# EasyEDA Pro project ProPrj_ETHlink8DAC_V1.0.epro, schematic ETHlink8xDAC_Schematic

## Sheets
1 DAC_1: Board Name: ETHlink8xDAC; Create Date: 2024-06-12; Page Name: DAC_1; Project Name: ETHlink8out; Schematic Name: ETHlink8xDAC_Schematic; Update Date: 2024-06-13; Company: EasyEDA.com; Drawn: Eugenio Mancini; Page Size: A4; Part Number: JLCPCB-002; Reviewed: EasyEDA; Version: V1.0
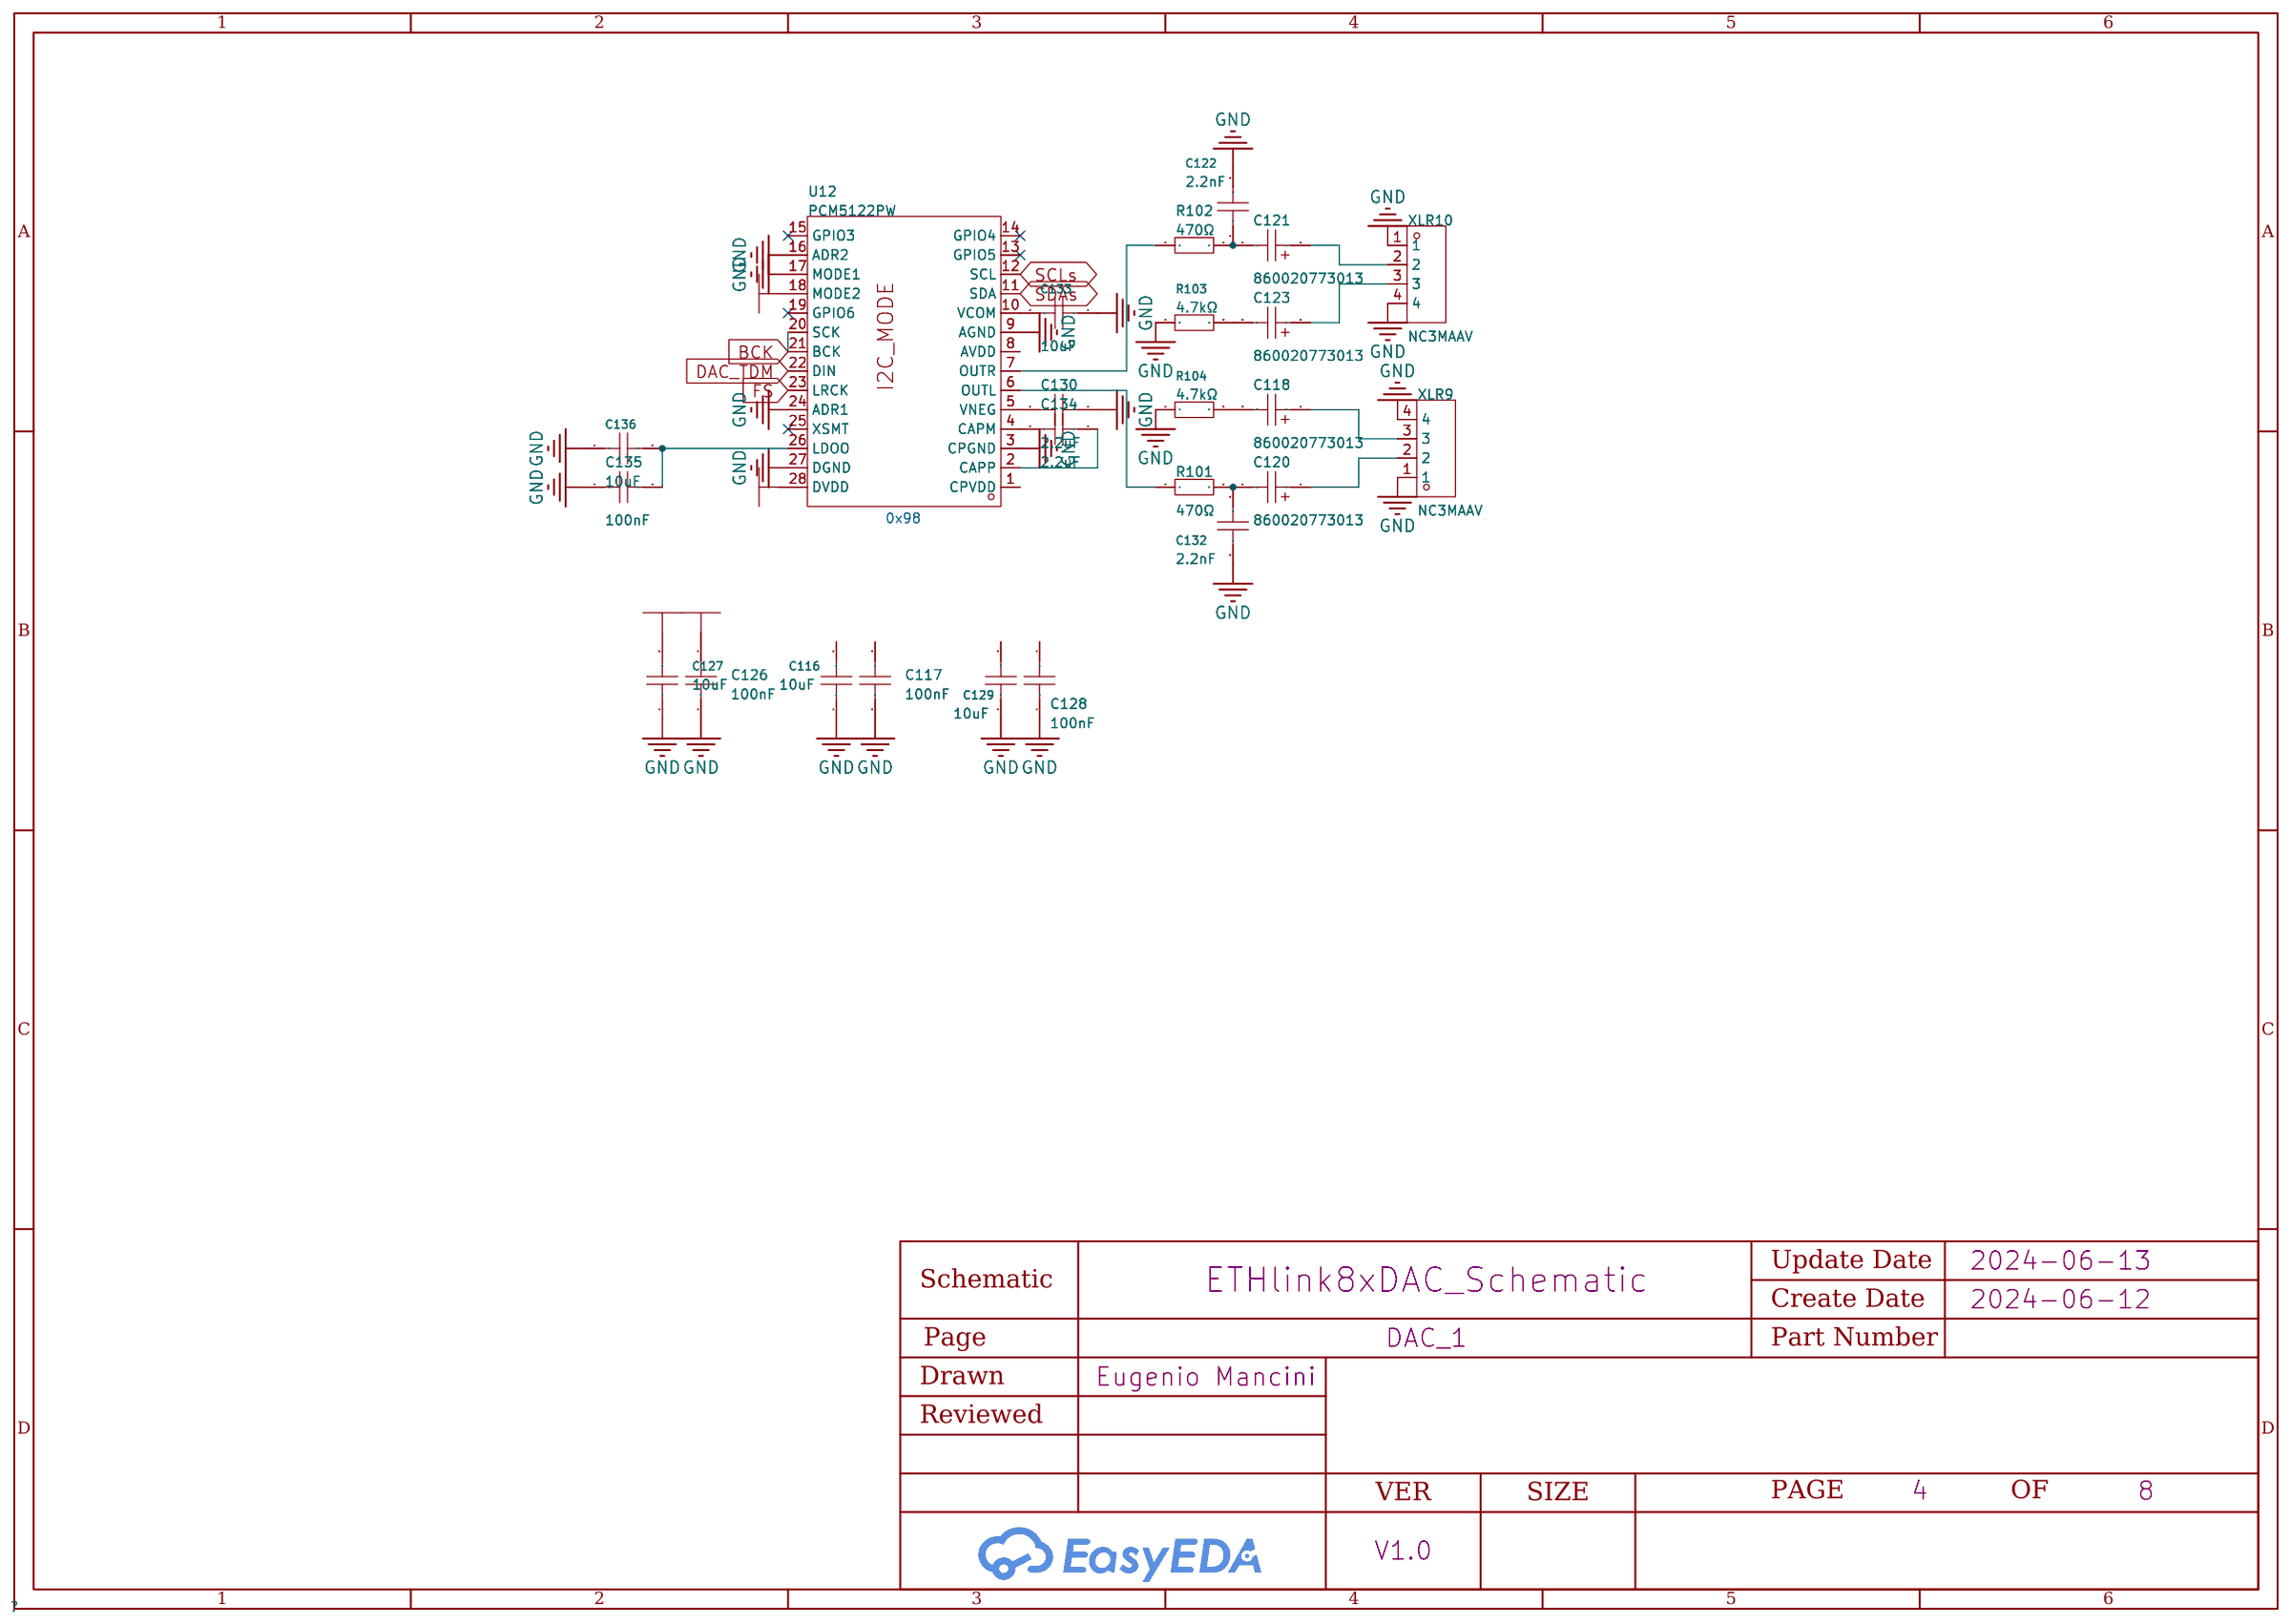
[diagram p0: DAC_1]
2 DAC_2: Page Name: DAC_2
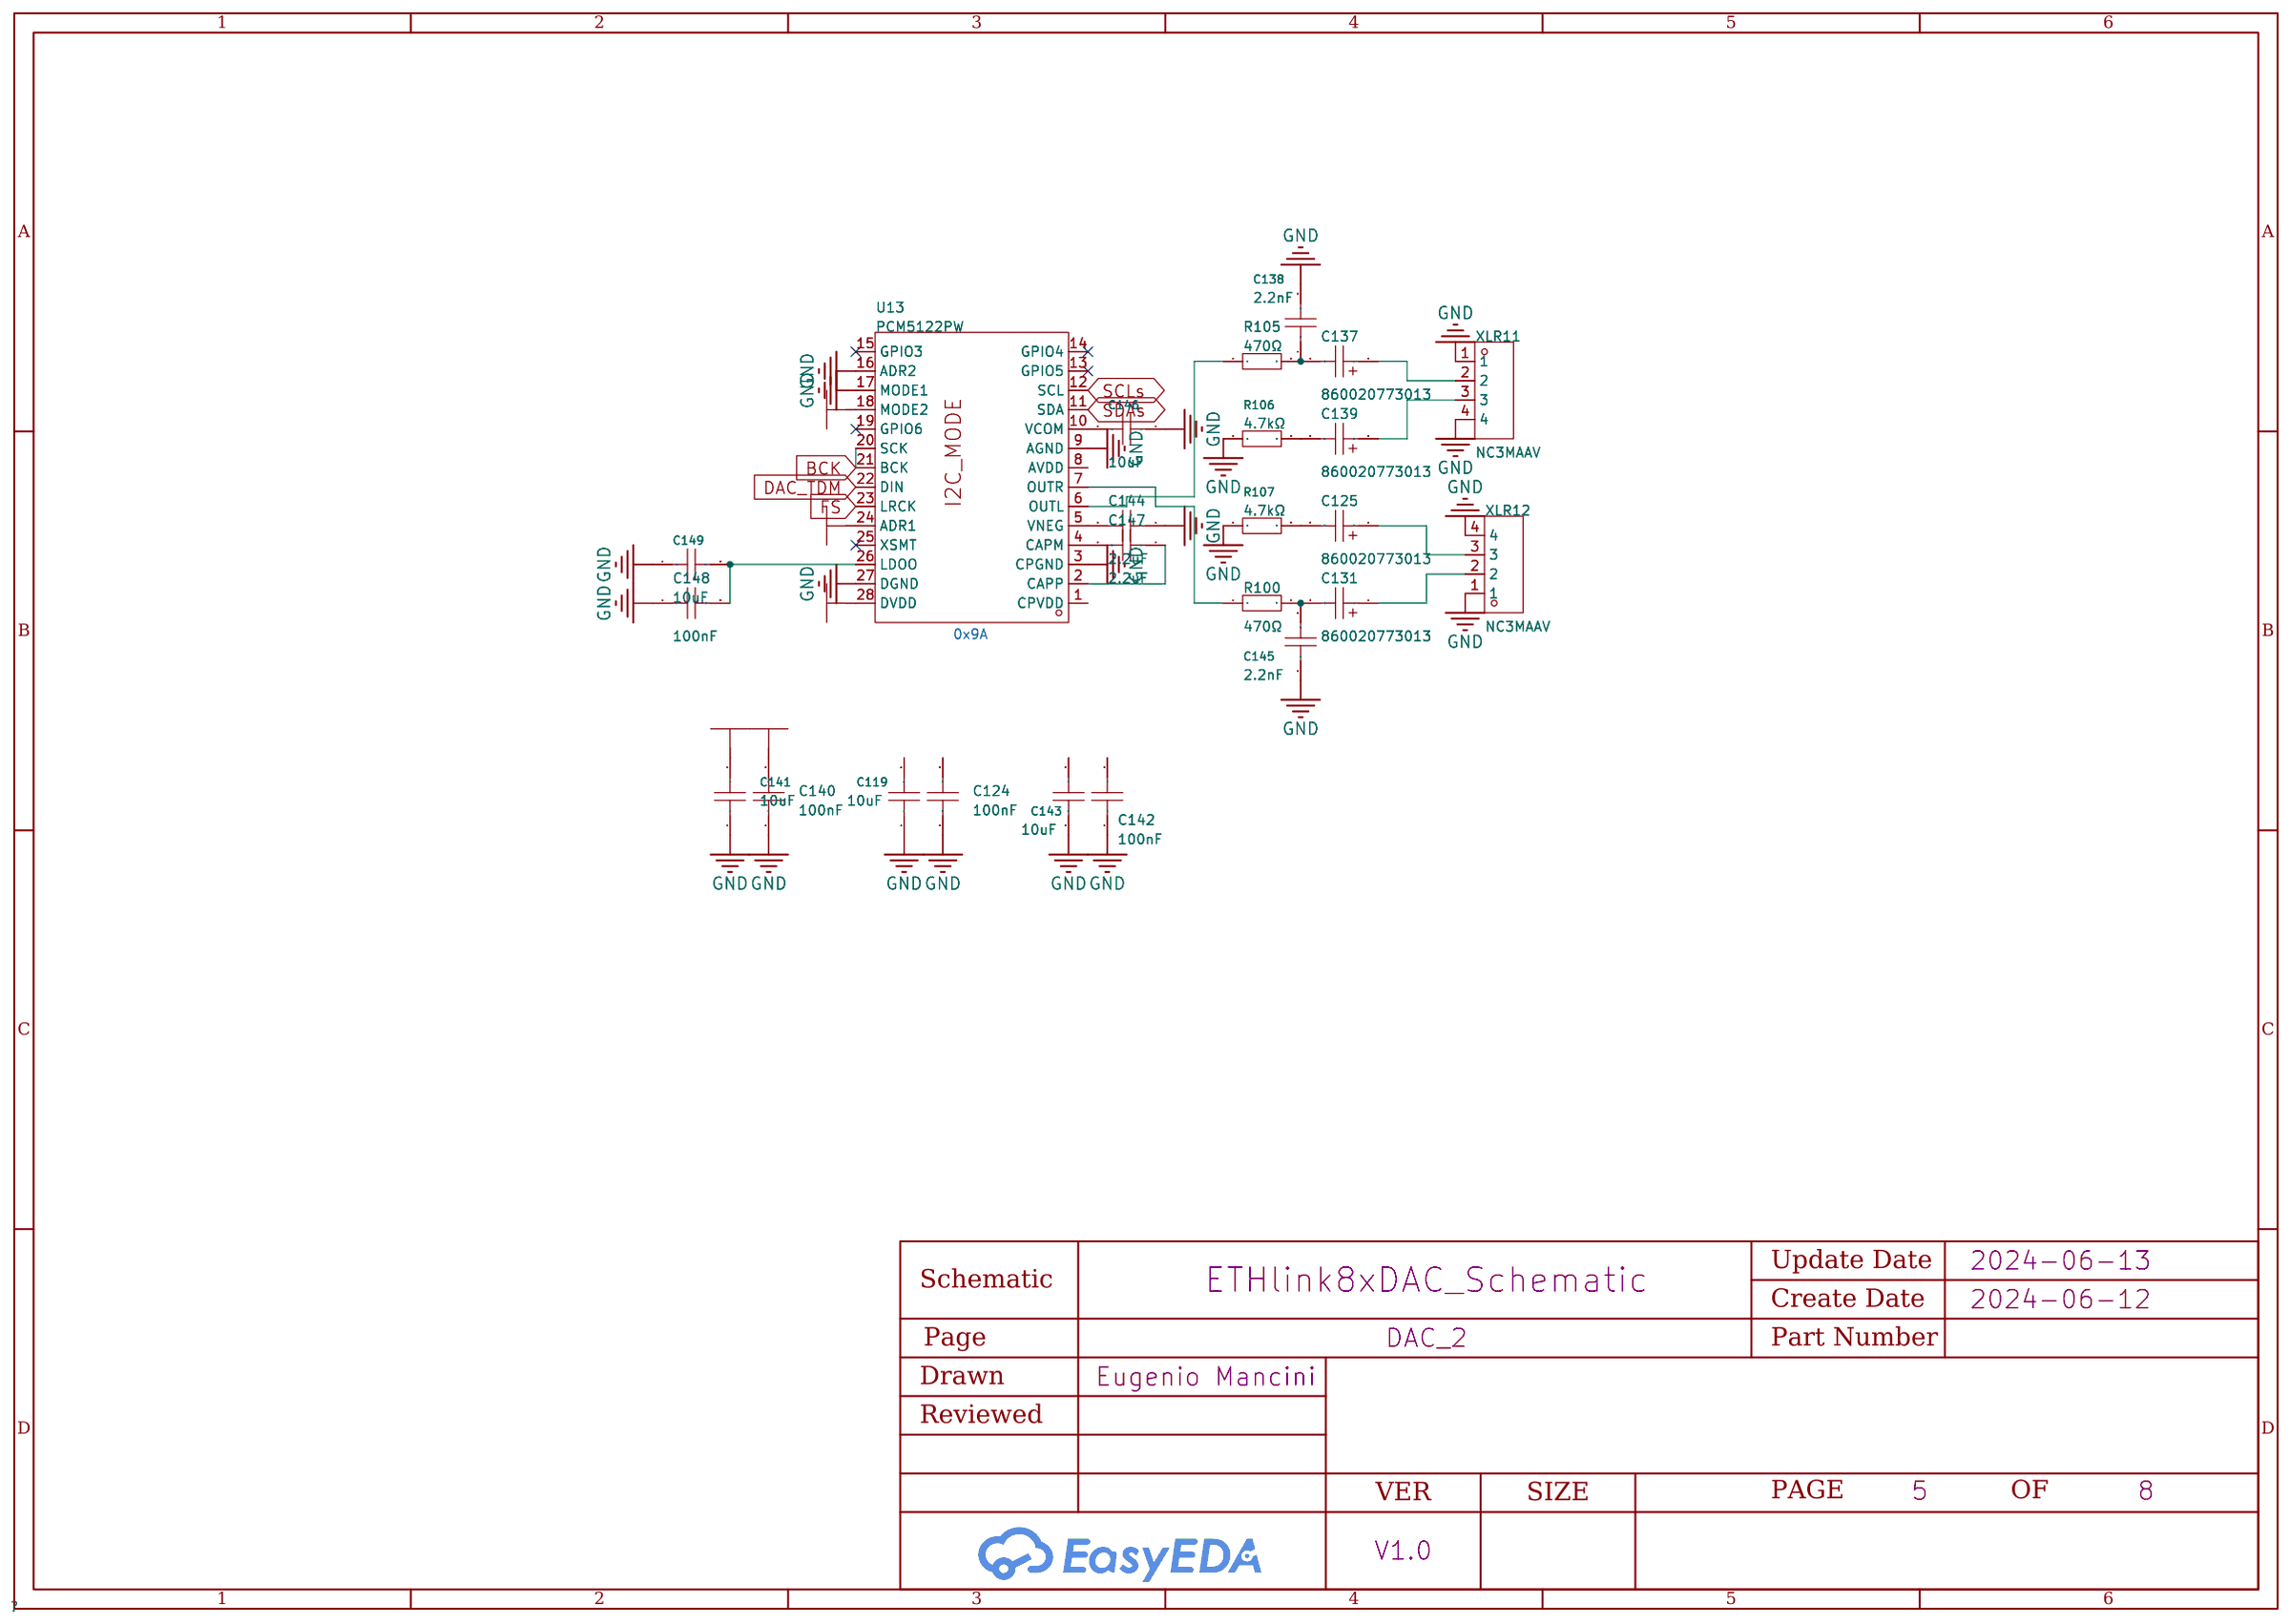
[diagram p1: DAC_2]
3 DAC_3: Page Name: DAC_3
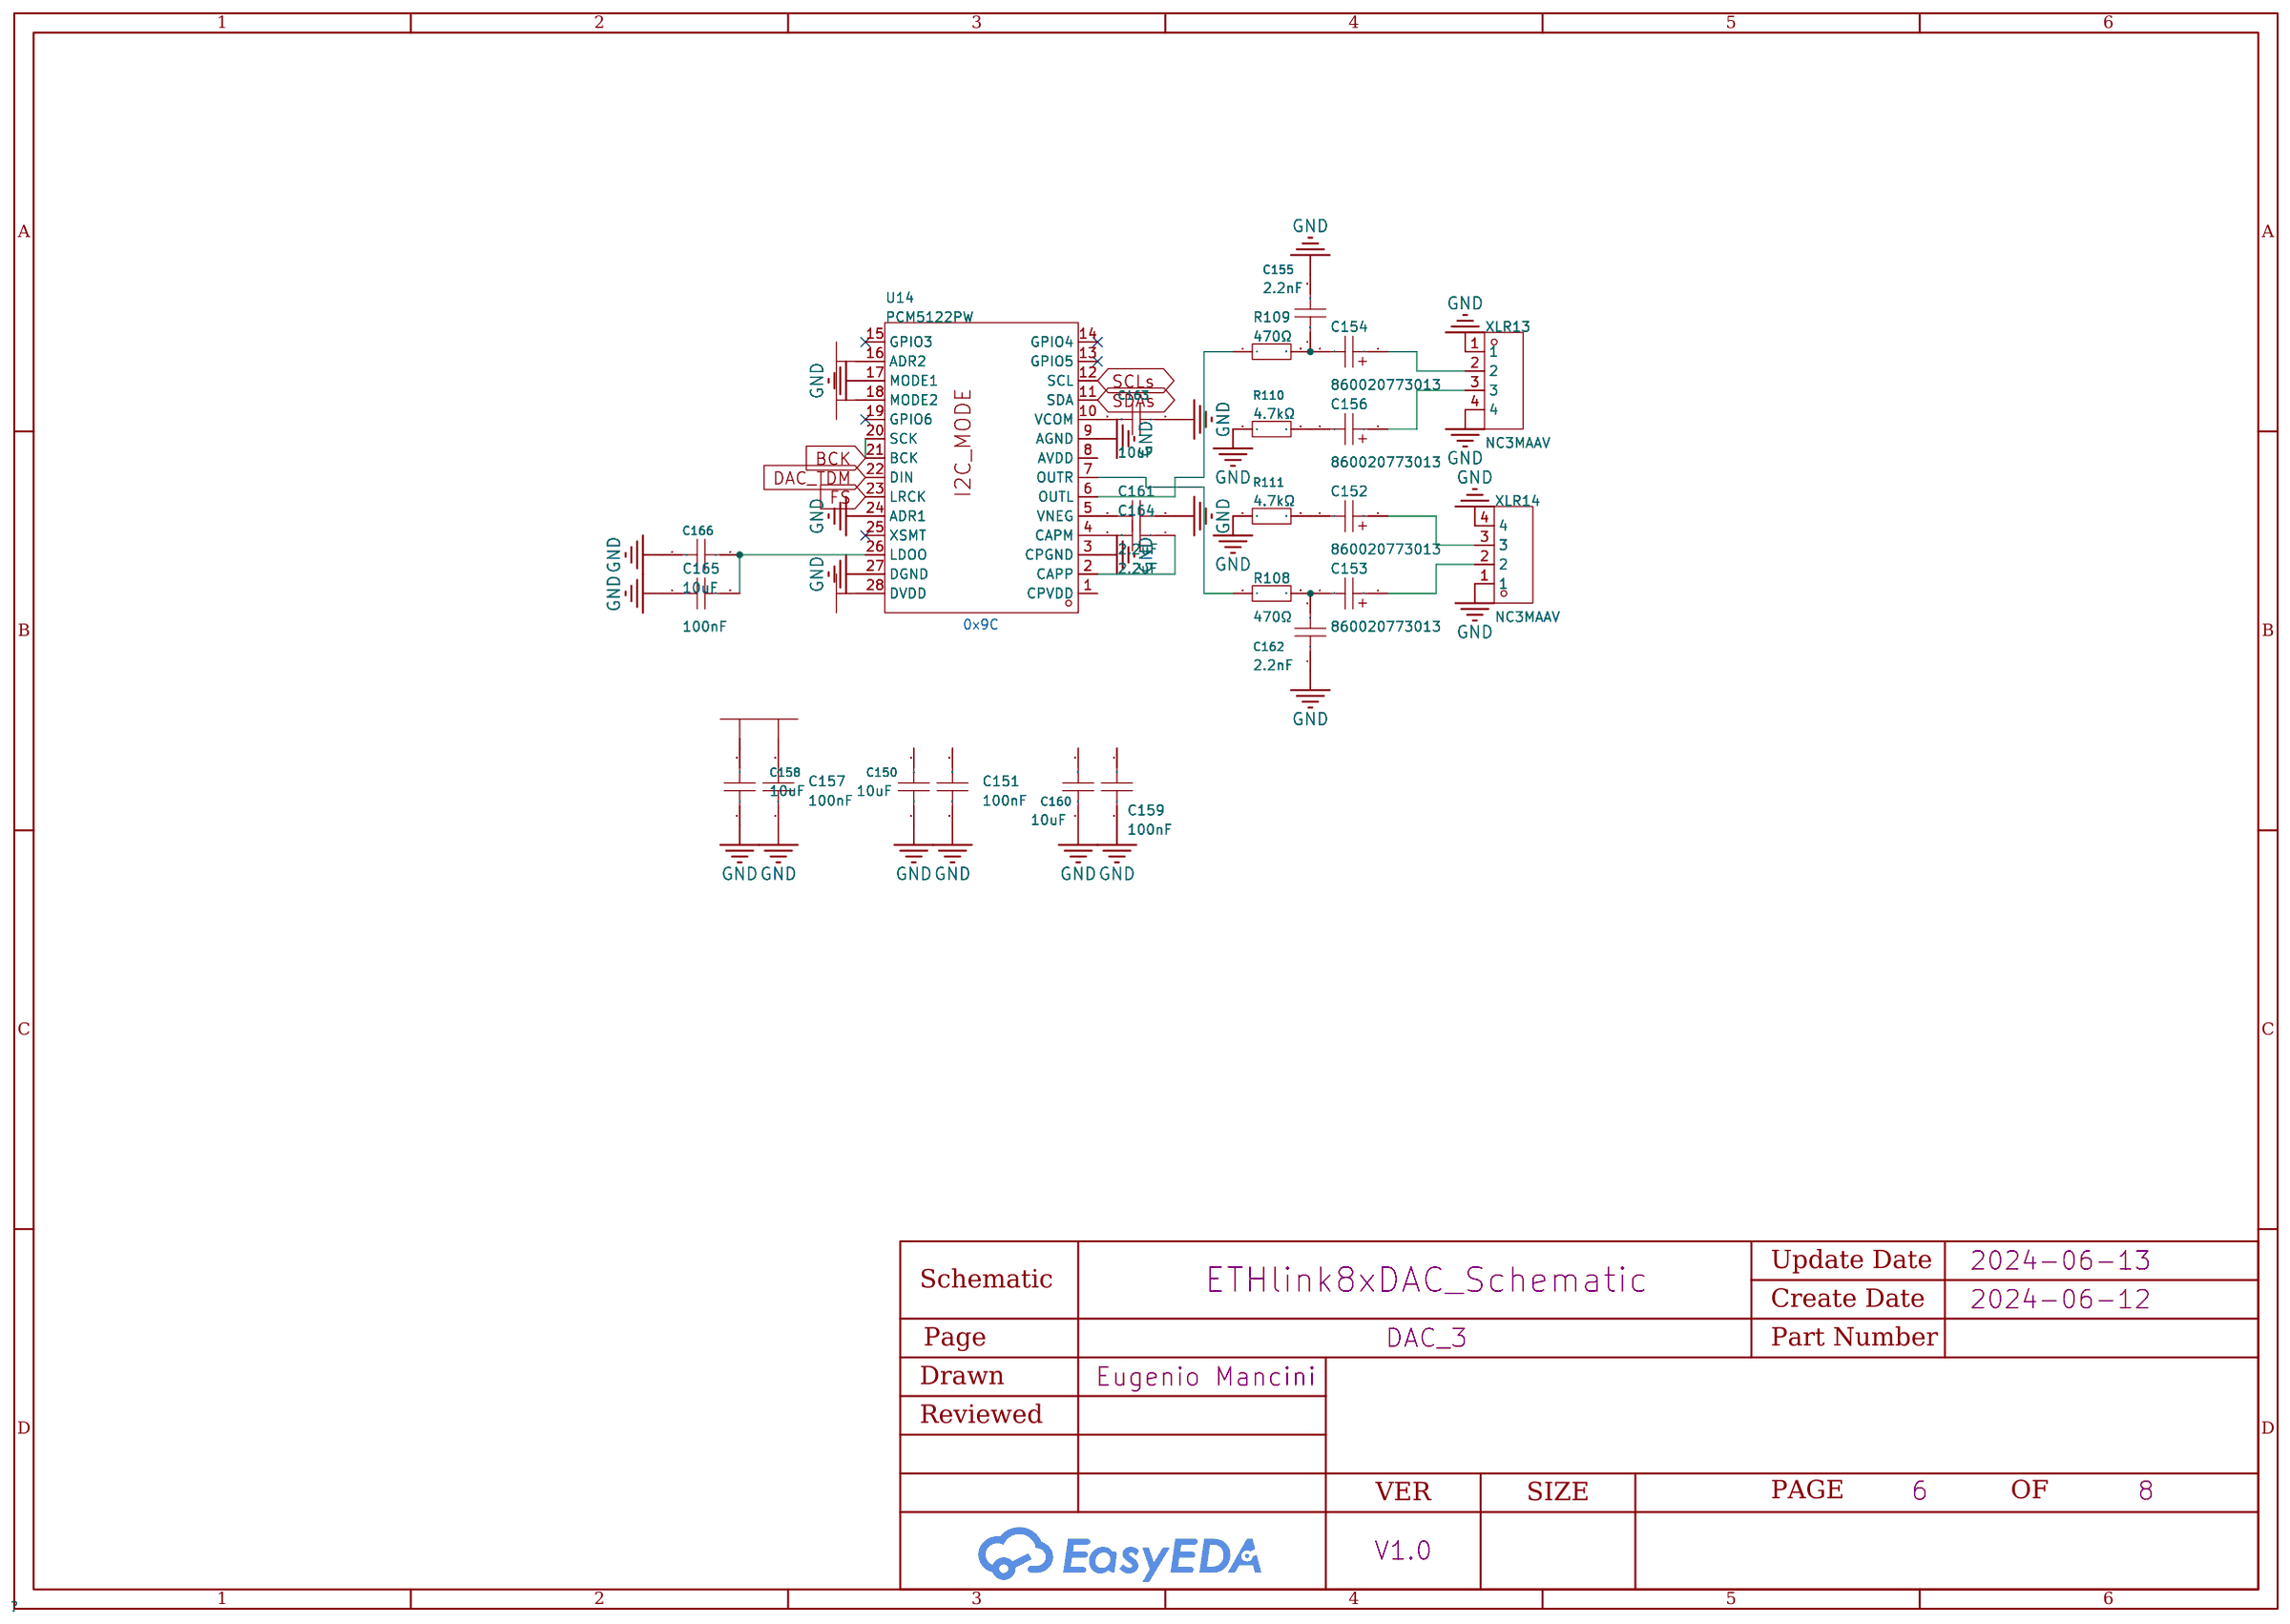
[diagram p2: DAC_3]
4 DAC_4: Page Name: DAC_4; Update Date: 2025-03-30
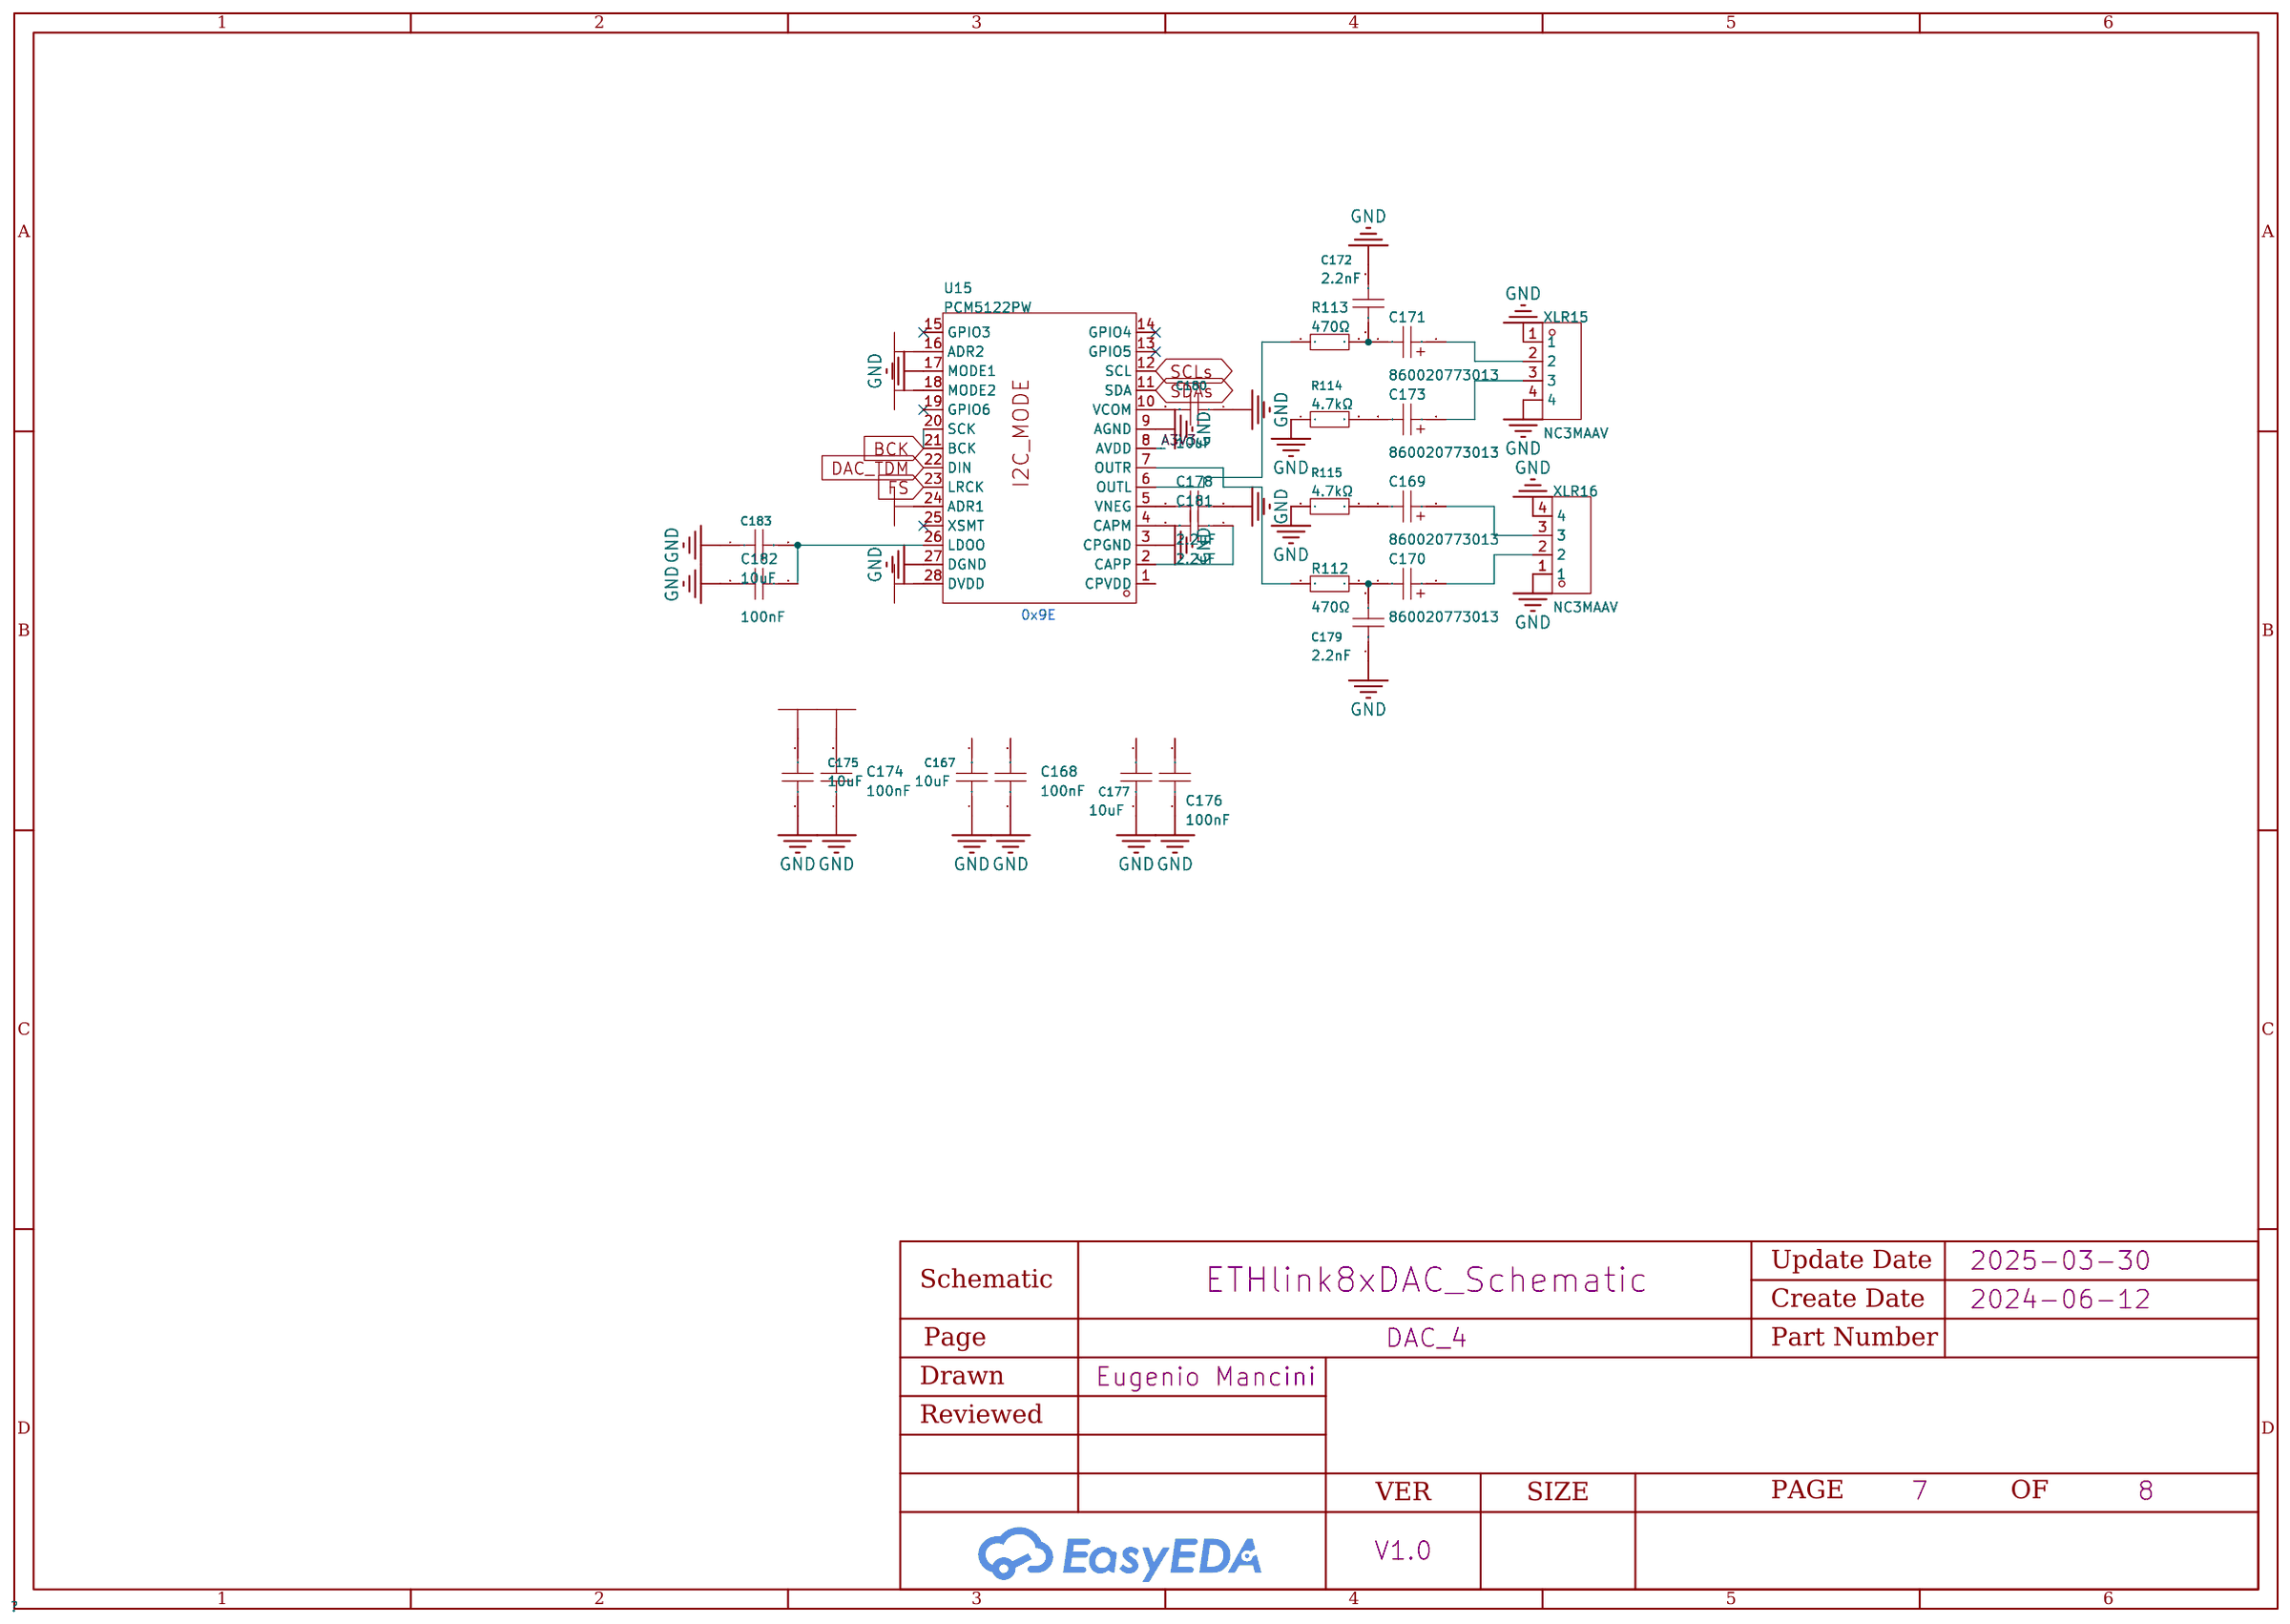
[diagram p3: DAC_4]
5 ETHERNET_PHY: Page Name: ETHERNET_PHY; Update Date: 2025-03-27
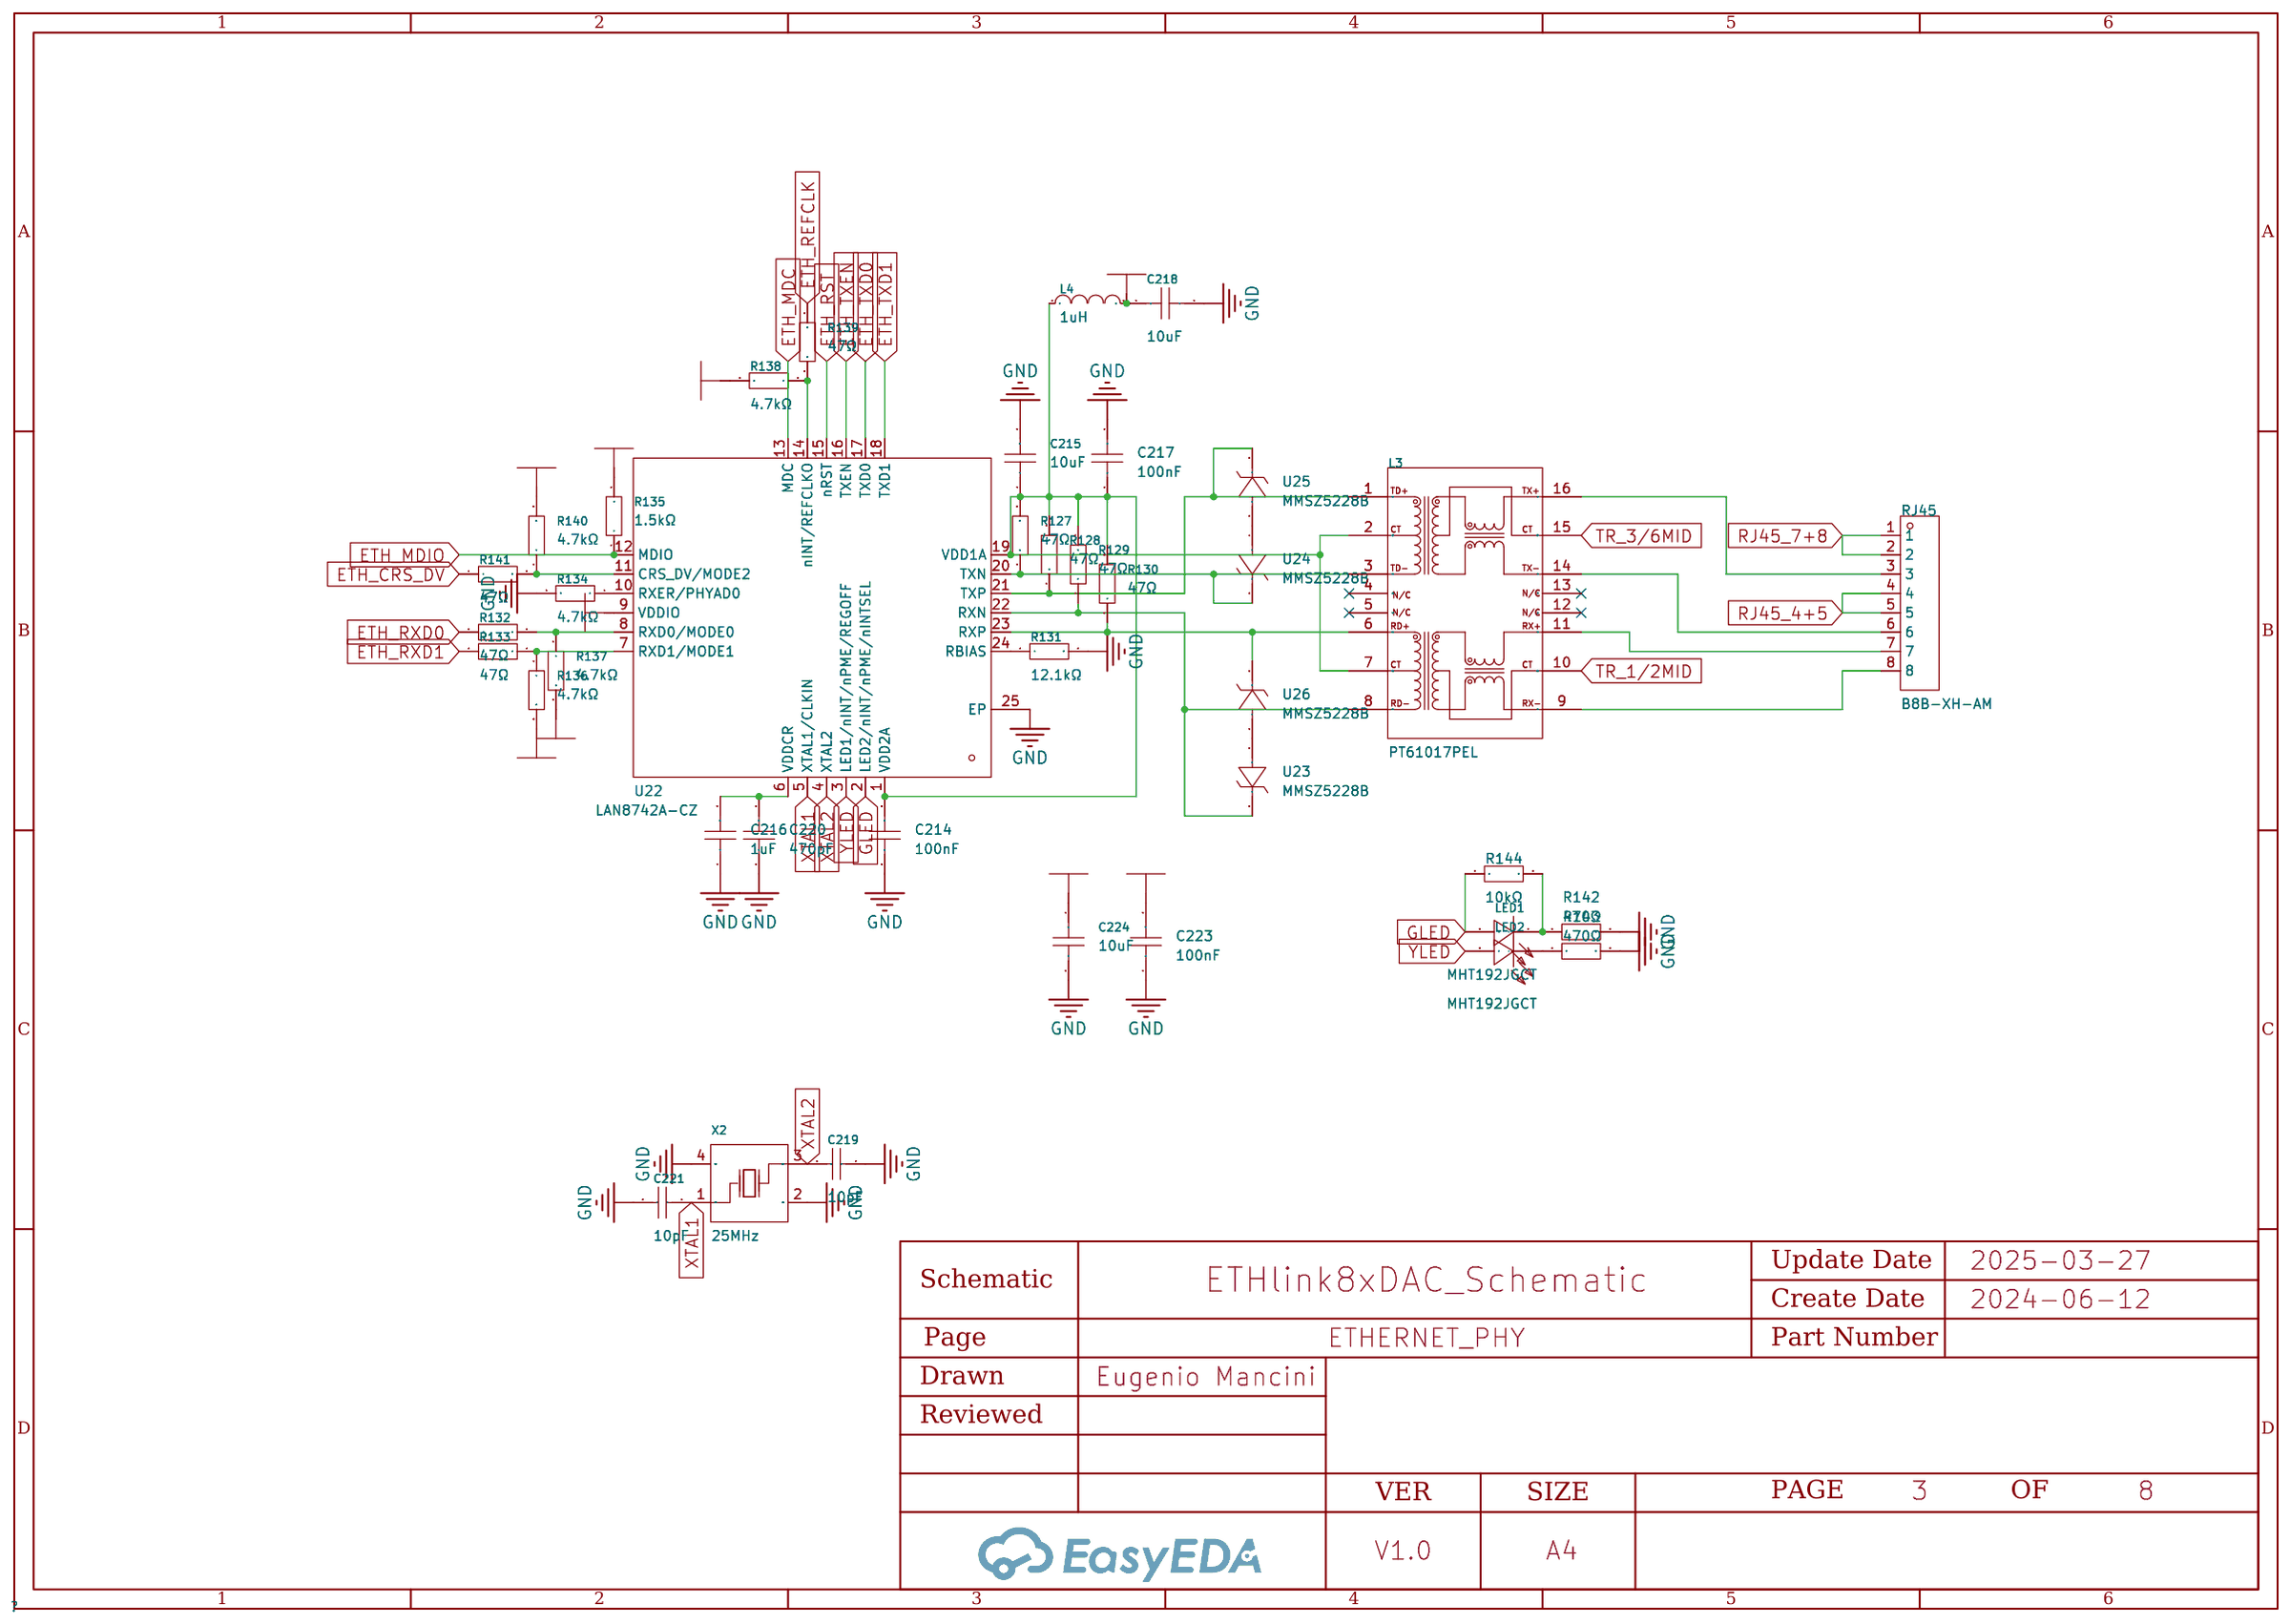
[diagram p4: ETHERNET_PHY]
6 MCU: Page Name: MCU; Update Date: 2024-07-15
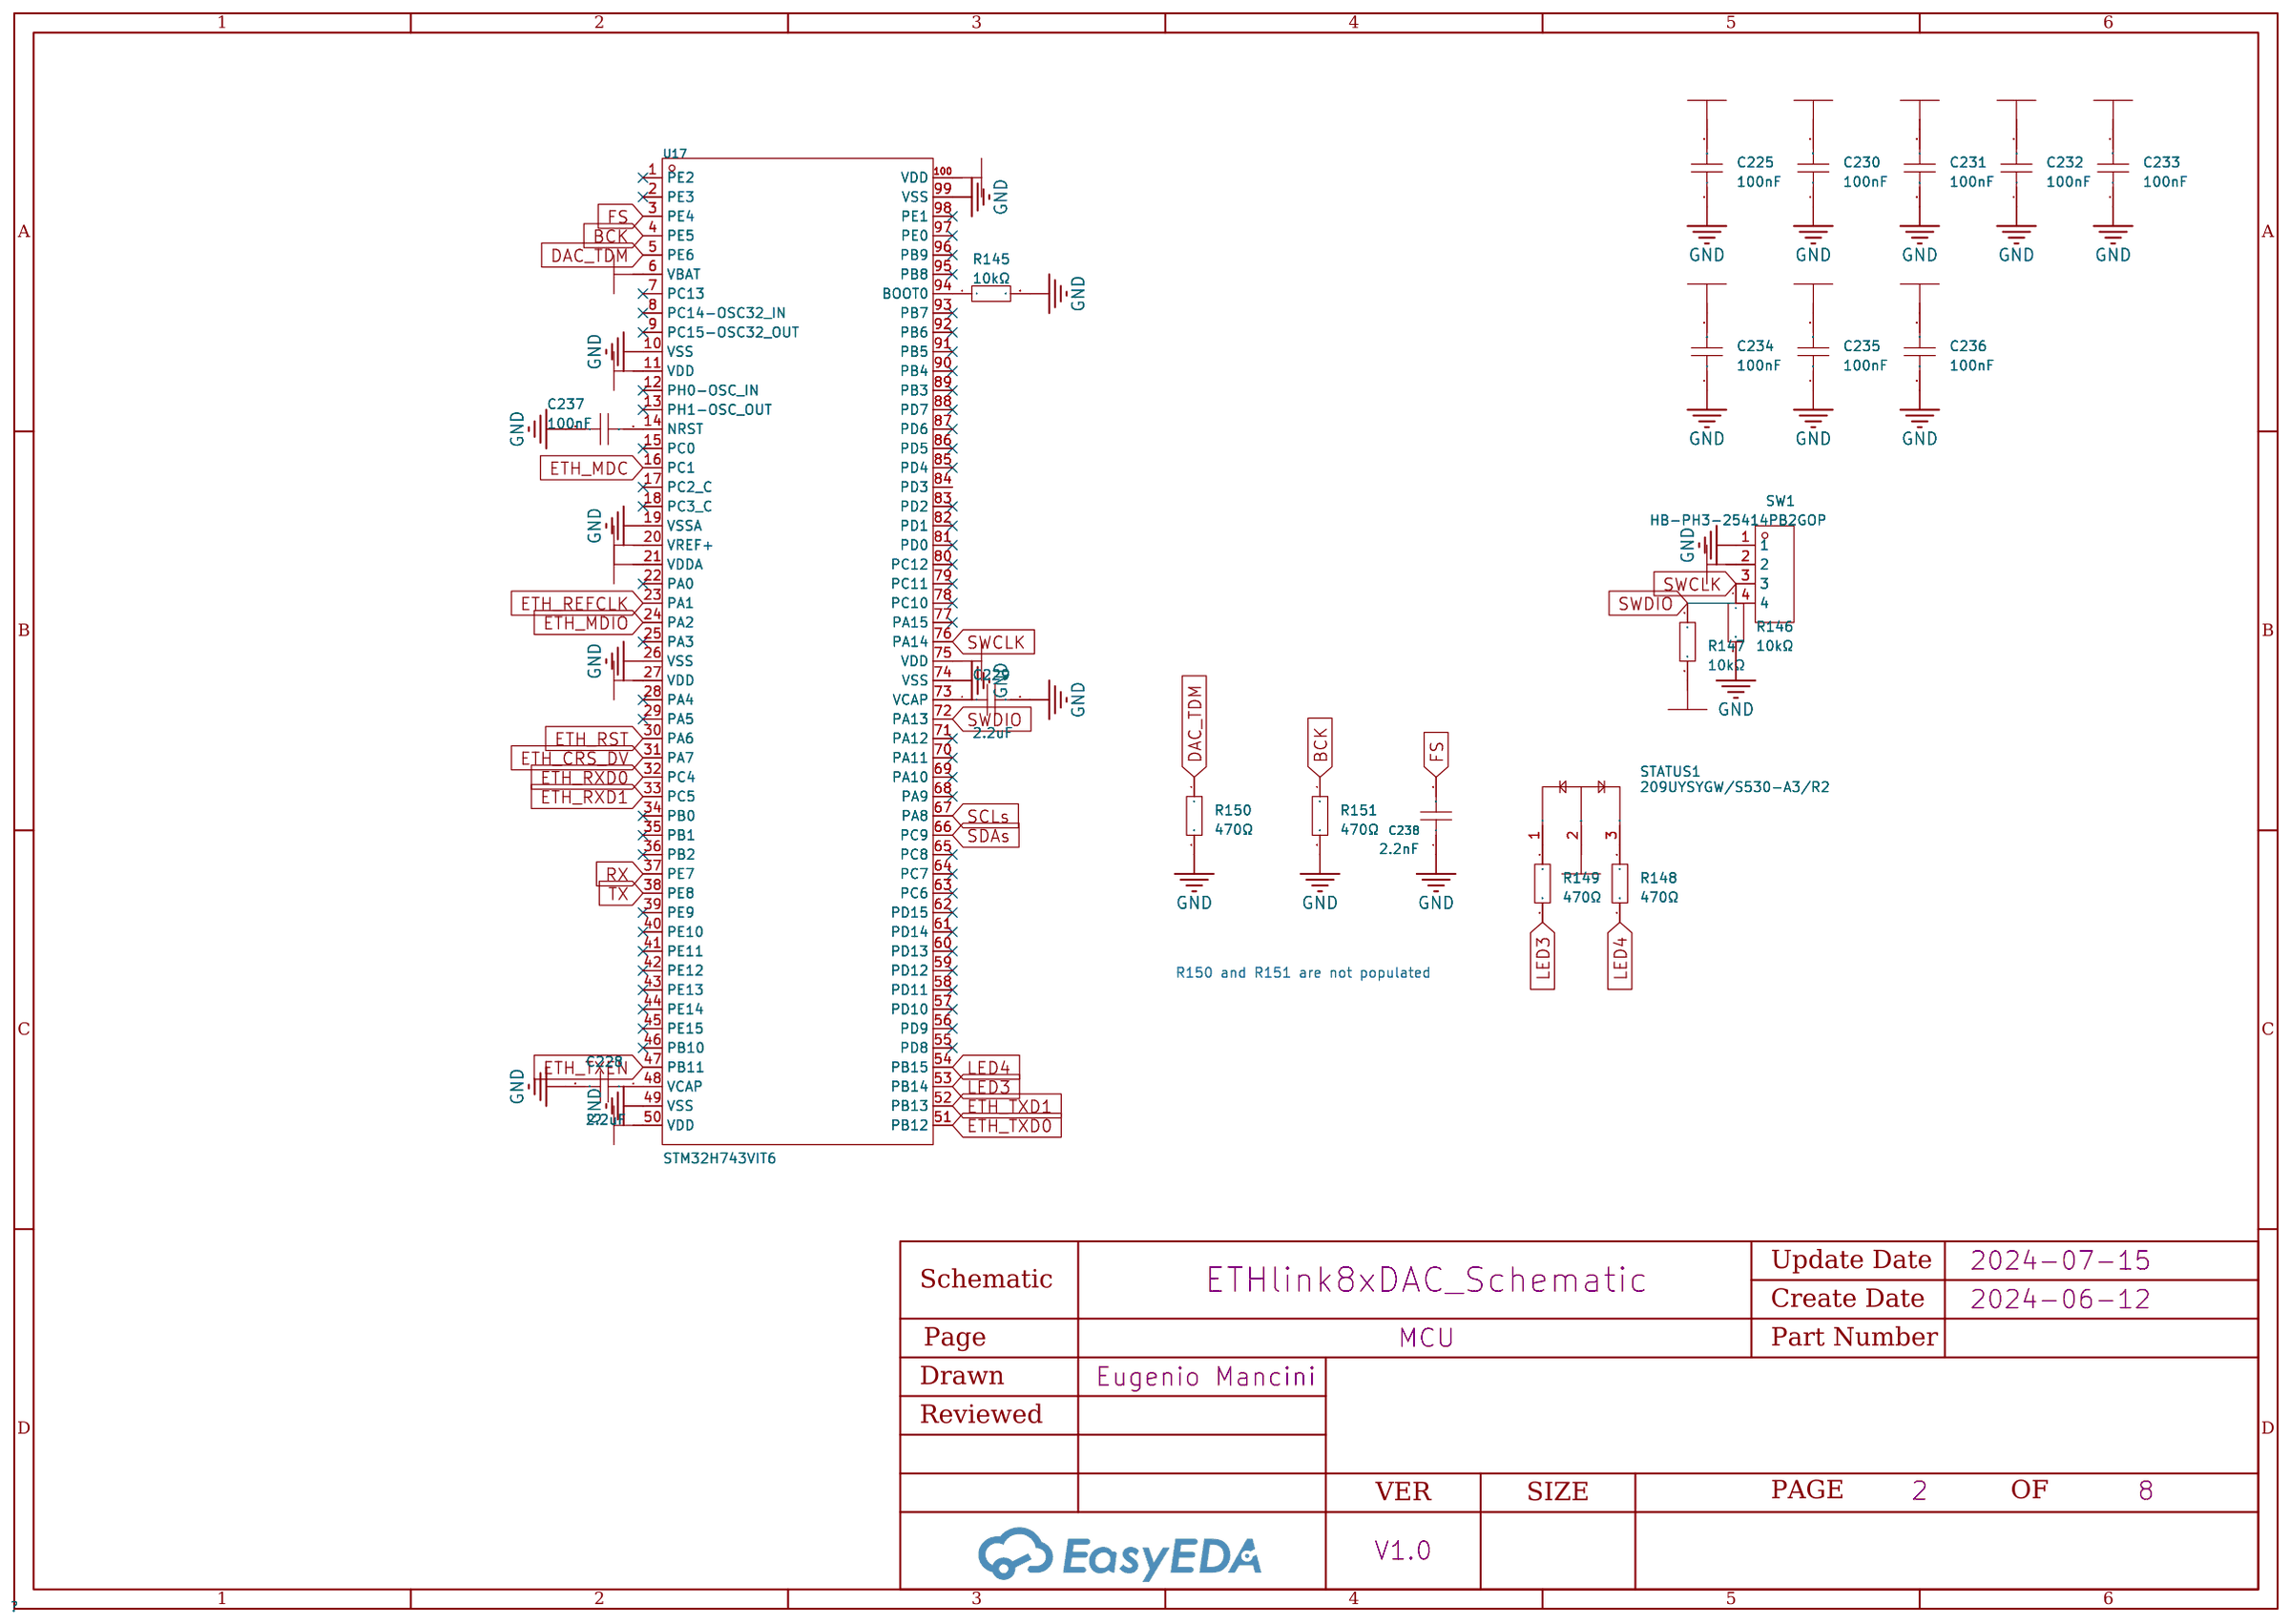
[diagram p5: MCU]
7 PSU: Page Name: PSU; Update Date: 2025-03-29
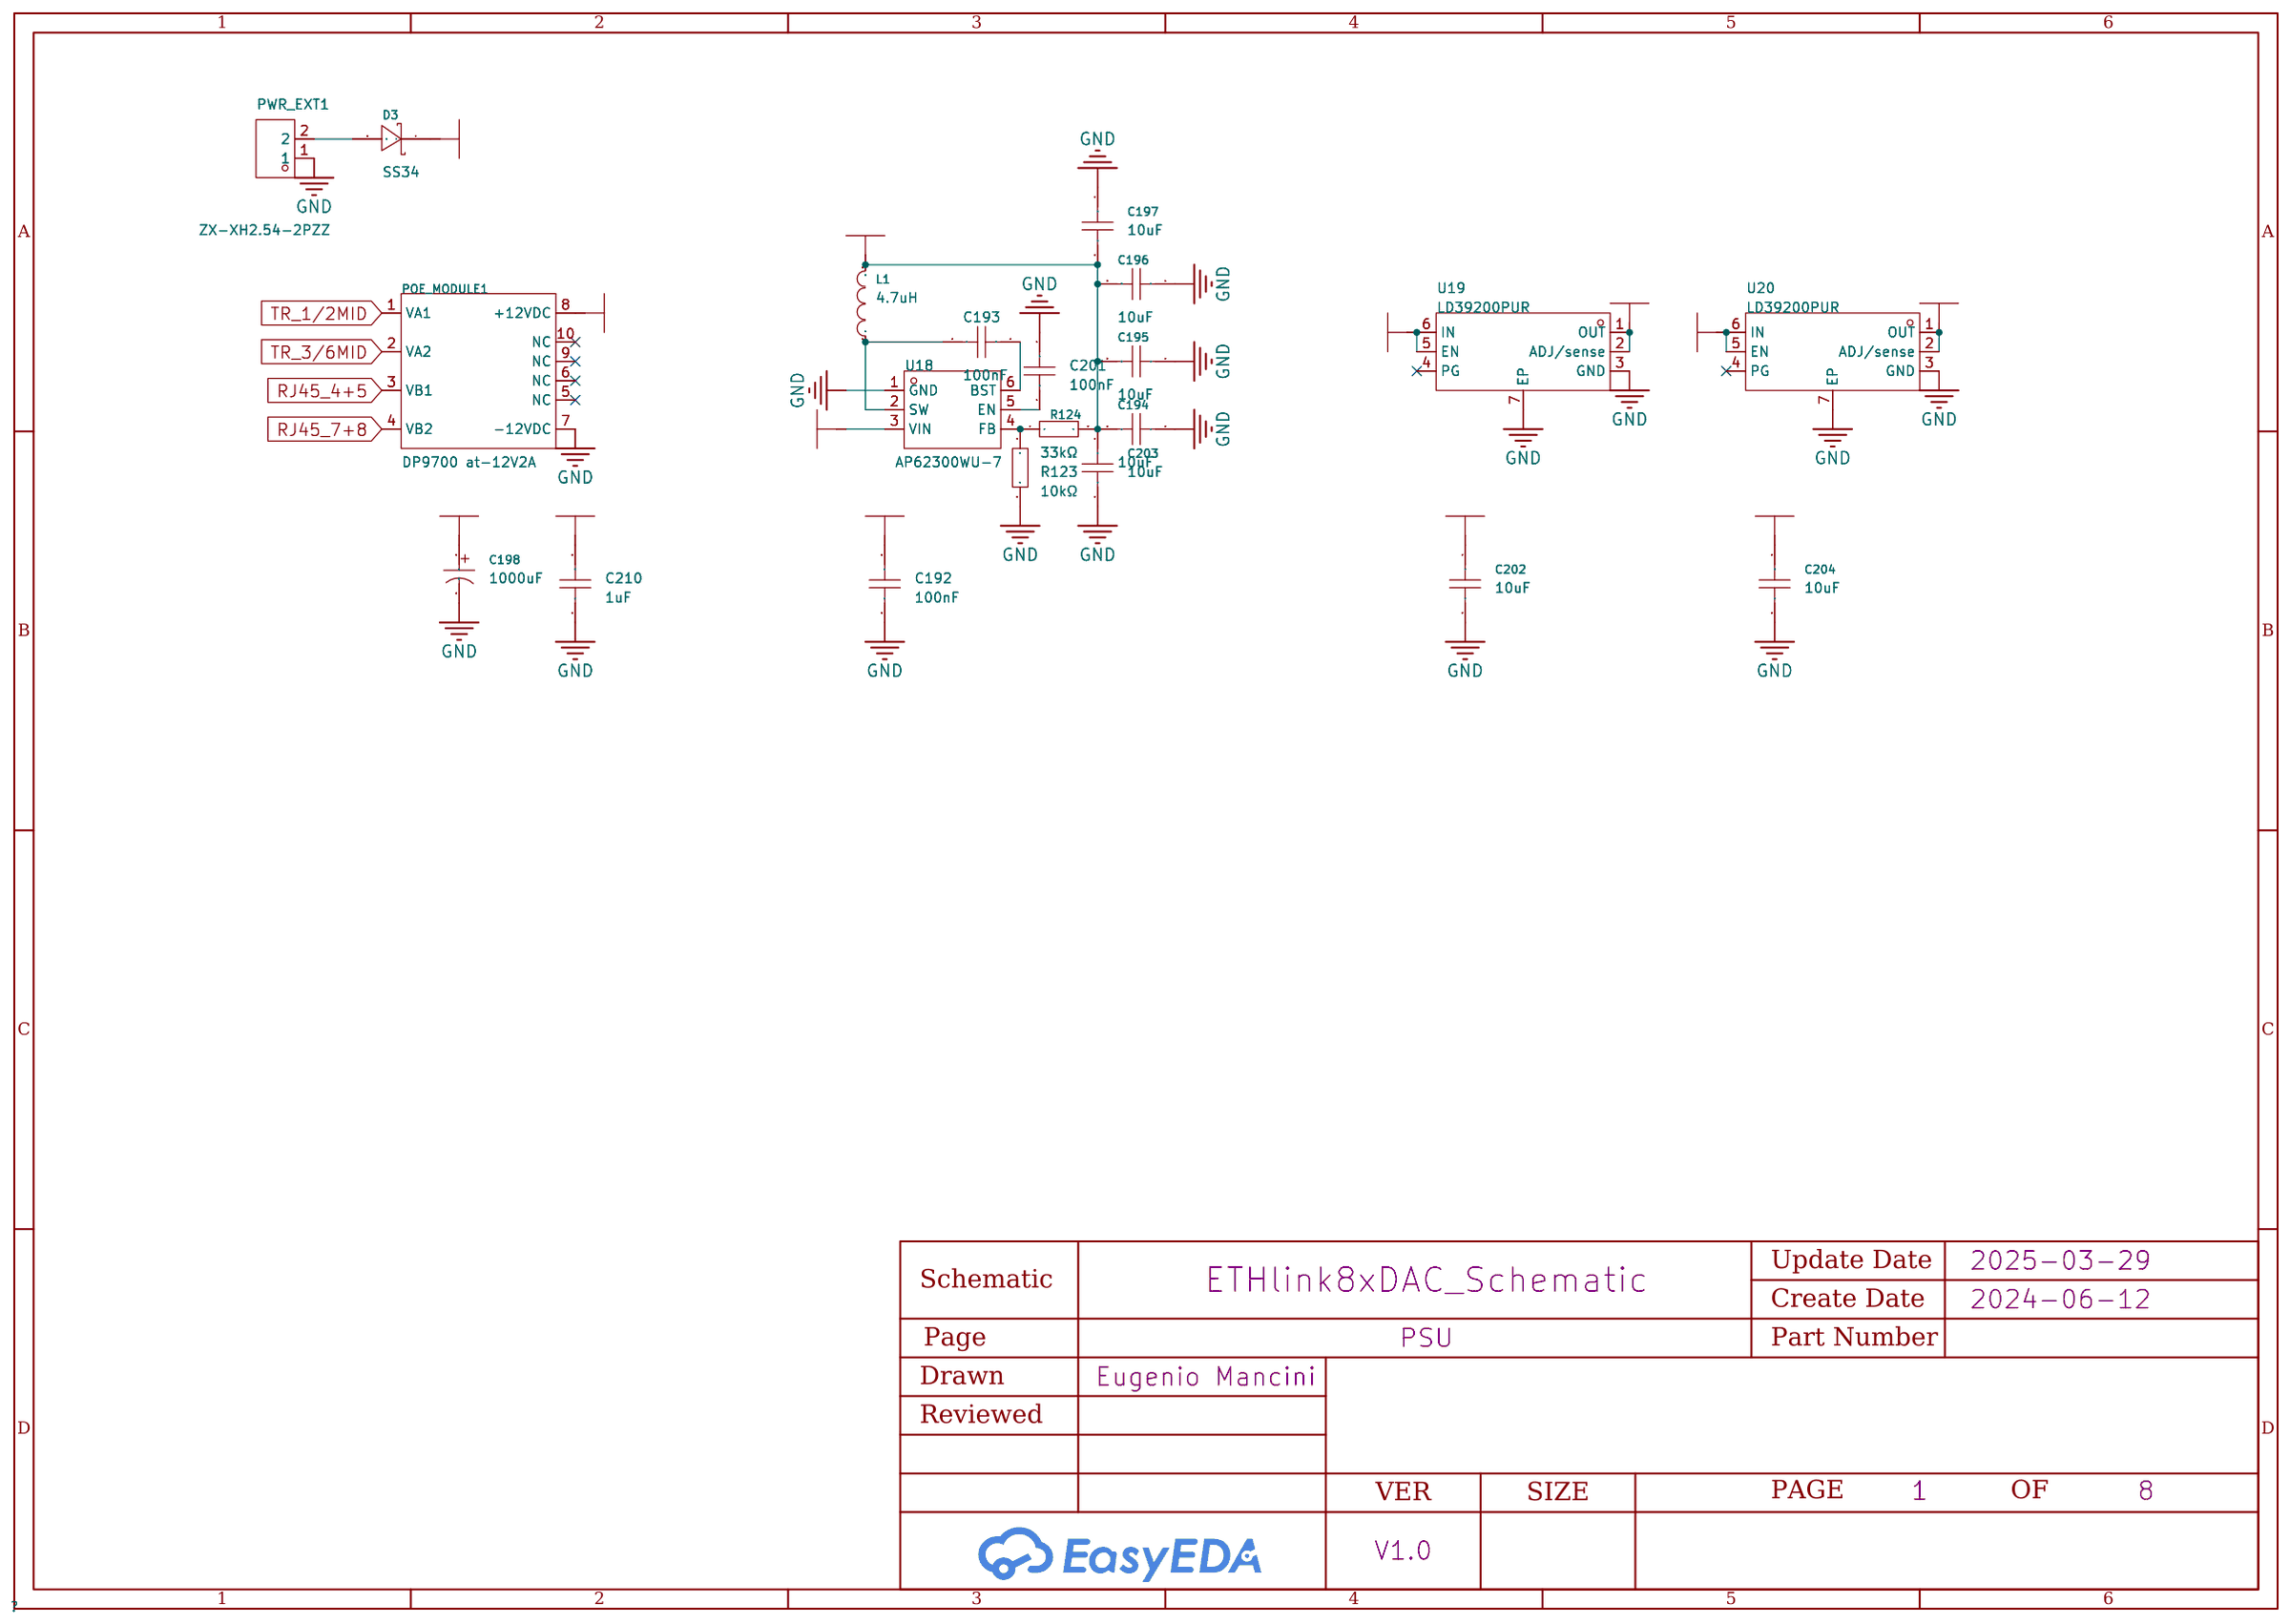
[diagram p6: PSU]
8 CLOCK: Create Date: 2024-06-13; Page Name: CLOCK; Drawn: eugenio mancini; Version: V0.1
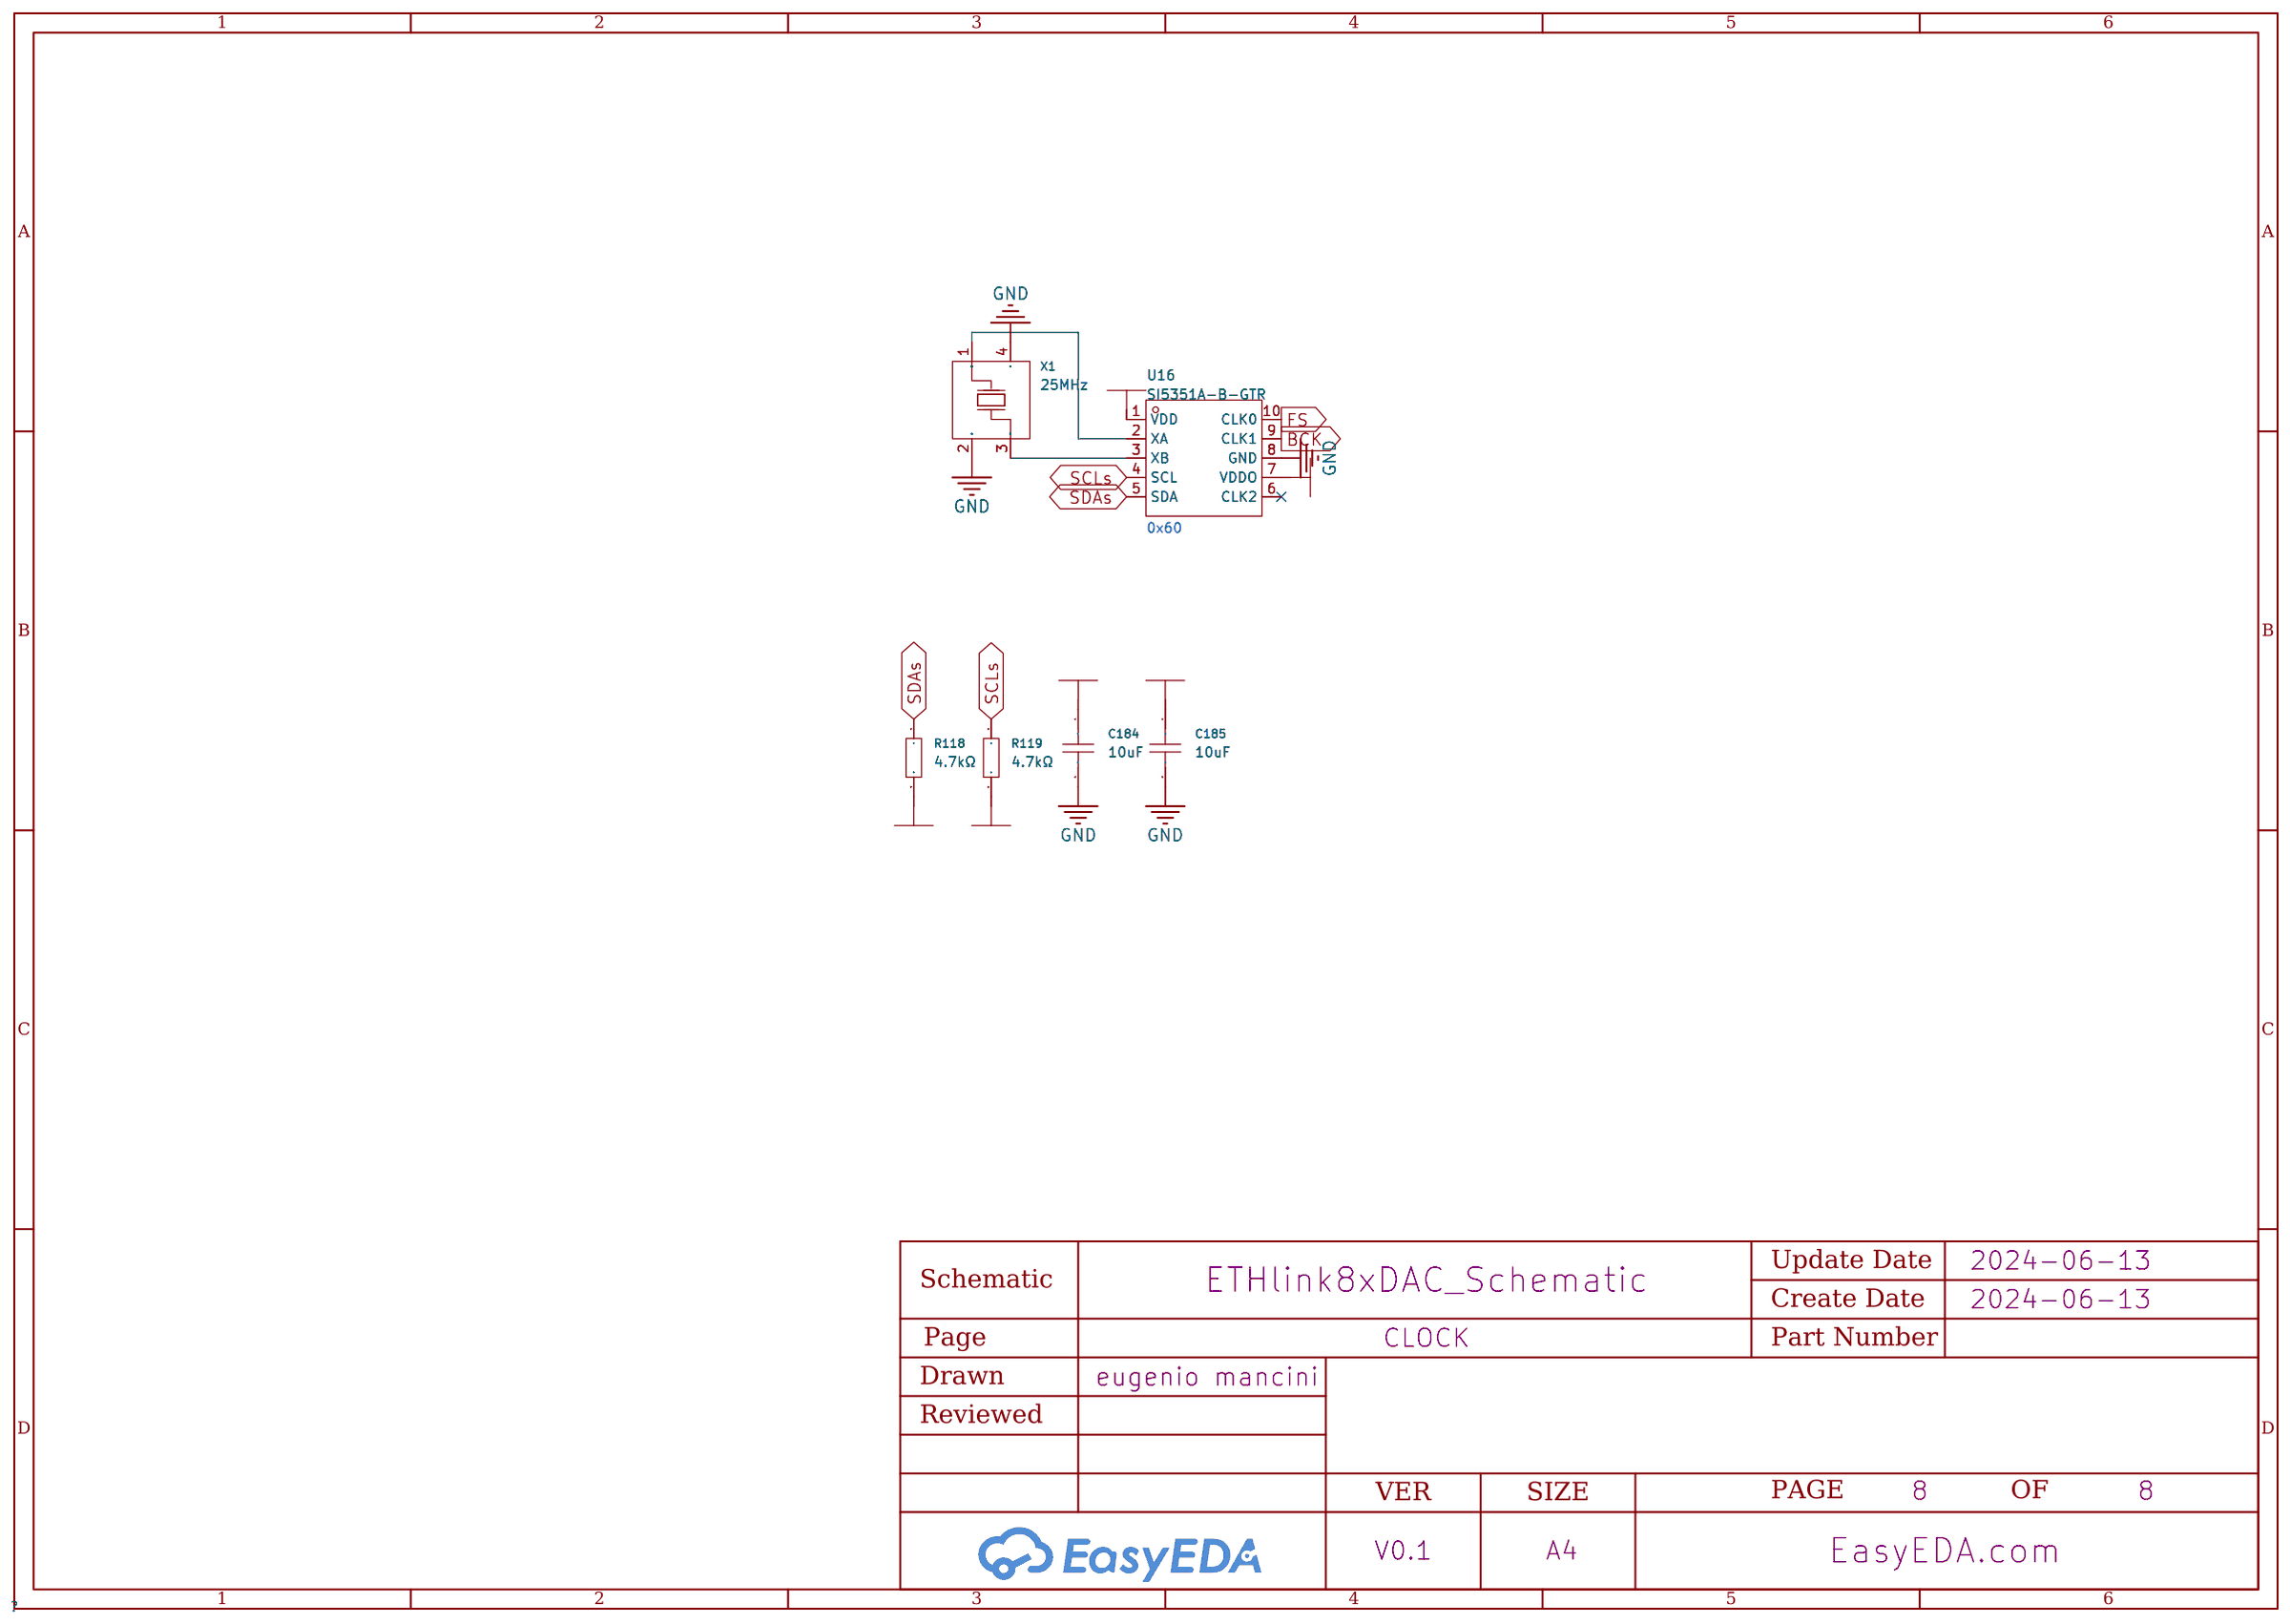
[diagram p7: CLOCK]

## Parts
sheet CLOCK
C184  10uF  [C0603]
C185  10uF  [C0603]
R118  4.7kΩ  [R0603]
R119  4.7kΩ  [R0603]
U16  SI5351A-B-GTR  [MSOP-10_L3.0-W3.0-P0.50-LS5.0-BL]
X1  25MHz  [CRYSTAL-SMD_4P-L3.2-W2.5-BL]
sheet DAC_1
C116  10uF  [C0603]
C117  100nF  [C0603]
C118  860020773013  [CAP-TH_BD6.3-P2.50-D0.5-FD]
C120  860020773013  [CAP-TH_BD6.3-P2.50-D0.5-FD]
C121  860020773013  [CAP-TH_BD6.3-P2.50-D0.5-FD]
C122  2.2nF  [C0603]
C123  860020773013  [CAP-TH_BD6.3-P2.50-D0.5-FD]
C126  100nF  [C0603]
C127  10uF  [C0603]
C128  100nF  [C0603]
C129  10uF  [C0603]
C130  2.2uF  [C0603]
C132  2.2nF  [C0603]
C133  10uF  [C0603]
C134  2.2uF  [C0603]
C135  100nF  [C0603]
C136  10uF  [C0603]
R101  470Ω  [R0603]
R102  470Ω  [R0603]
R103  4.7kΩ  [R0603]
R104  4.7kΩ  [R0603]
U12  PCM5122PW  [TSSOP-28_L9.8-W6.6-P0.65-BL]
XLR9  NC3MAAV  [CONN-TH_NC3MAAV]
XLR10  NC3MAAV  [CONN-TH_NC3MAAV]
sheet DAC_2
C119  10uF  [C0603]
C124  100nF  [C0603]
C125  860020773013  [CAP-TH_BD6.3-P2.50-D0.5-FD]
C131  860020773013  [CAP-TH_BD6.3-P2.50-D0.5-FD]
C137  860020773013  [CAP-TH_BD6.3-P2.50-D0.5-FD]
C138  2.2nF  [C0603]
C139  860020773013  [CAP-TH_BD6.3-P2.50-D0.5-FD]
C140  100nF  [C0603]
C141  10uF  [C0603]
C142  100nF  [C0603]
C143  10uF  [C0603]
C144  2.2uF  [C0603]
C145  2.2nF  [C0603]
C146  10uF  [C0603]
C147  2.2uF  [C0603]
C148  100nF  [C0603]
C149  10uF  [C0603]
R100  470Ω  [R0603]
R105  470Ω  [R0603]
R106  4.7kΩ  [R0603]
R107  4.7kΩ  [R0603]
U13  PCM5122PW  [TSSOP-28_L9.8-W6.6-P0.65-BL]
XLR11  NC3MAAV  [CONN-TH_NC3MAAV]
XLR12  NC3MAAV  [CONN-TH_NC3MAAV]
sheet DAC_3
C150  10uF  [C0603]
C151  100nF  [C0603]
C152  860020773013  [CAP-TH_BD6.3-P2.50-D0.5-FD]
C153  860020773013  [CAP-TH_BD6.3-P2.50-D0.5-FD]
C154  860020773013  [CAP-TH_BD6.3-P2.50-D0.5-FD]
C155  2.2nF  [C0603]
C156  860020773013  [CAP-TH_BD6.3-P2.50-D0.5-FD]
C157  100nF  [C0603]
C158  10uF  [C0603]
C159  100nF  [C0603]
C160  10uF  [C0603]
C161  2.2uF  [C0603]
C162  2.2nF  [C0603]
C163  10uF  [C0603]
C164  2.2uF  [C0603]
C165  100nF  [C0603]
C166  10uF  [C0603]
R108  470Ω  [R0603]
R109  470Ω  [R0603]
R110  4.7kΩ  [R0603]
R111  4.7kΩ  [R0603]
U14  PCM5122PW  [TSSOP-28_L9.8-W6.6-P0.65-BL]
XLR13  NC3MAAV  [CONN-TH_NC3MAAV]
XLR14  NC3MAAV  [CONN-TH_NC3MAAV]
sheet DAC_4
C167  10uF  [C0603]
C168  100nF  [C0603]
C169  860020773013  [CAP-TH_BD6.3-P2.50-D0.5-FD]
C170  860020773013  [CAP-TH_BD6.3-P2.50-D0.5-FD]
C171  860020773013  [CAP-TH_BD6.3-P2.50-D0.5-FD]
C172  2.2nF  [C0603]
C173  860020773013  [CAP-TH_BD6.3-P2.50-D0.5-FD]
C174  100nF  [C0603]
C175  10uF  [C0603]
C176  100nF  [C0603]
C177  10uF  [C0603]
C178  2.2uF  [C0603]
C179  2.2nF  [C0603]
C180  10uF  [C0603]
C181  2.2uF  [C0603]
C182  100nF  [C0603]
C183  10uF  [C0603]
R112  470Ω  [R0603]
R113  470Ω  [R0603]
R114  4.7kΩ  [R0603]
R115  4.7kΩ  [R0603]
U15  PCM5122PW  [TSSOP-28_L9.8-W6.6-P0.65-BL]
XLR15  NC3MAAV  [CONN-TH_NC3MAAV]
XLR16  NC3MAAV  [CONN-TH_NC3MAAV]
sheet ETHERNET_PHY
C214  100nF  [C0603]
C215  10uF  [C0603]
C216  1uF  [C0603]
C217  100nF  [C0603]
C218  10uF  [C0603]
C219  10pF  [C0603]
C220  470pF  [C0603]
C221  10pF  [C0603]
C223  100nF  [C0603]
C224  10uF  [C0603]
L3  PT61017PEL  [XFMR-SMD_PT61017PEL]
L4  1uH  [L1008]
LED1  MHT192JGCT  [LED0603-RD]
LED2  MHT192JGCT  [LED0603-RD]
R127  47Ω  [R0603]
R128  47Ω  [R0603]
R129  47Ω  [R0603]
R130  47Ω  [R0603]
R131  12.1kΩ  [R0603]
R132  47Ω  [R0603]
R133  47Ω  [R0603]
R134  4.7kΩ  [R0603]
R135  1.5kΩ  [R0603]
R136  4.7kΩ  [R0603]
R137  4.7kΩ  [R0603]
R138  4.7kΩ  [R0603]
R139  47Ω  [R0603]
R140  4.7kΩ  [R0603]
R141  47Ω  [R0603]
R142  470Ω  [R0603]
R143  470Ω  [R0603]
R144  10kΩ  [R0603]
RJ45  B8B-XH-AM  [CONN-TH_8P-P2.50_B8B-XH-AM-LF-SN]
U22  LAN8742A-CZ  [QFN-24_L4.0-W4.0-P0.50-BL-EP2.6]
U23  MMSZ5228B  [SOD-123_L2.8-W1.8-LS3.9-FD]
U24  MMSZ5228B  [SOD-123_L2.8-W1.8-LS3.9-FD]
U25  MMSZ5228B  [SOD-123_L2.8-W1.8-LS3.9-FD]
U26  MMSZ5228B  [SOD-123_L2.8-W1.8-LS3.9-FD]
X2  25MHz  [CRYSTAL-SMD_4P-L3.2-W2.5-BL]
sheet MCU
C225  100nF  [C0603]
C228  2.2uF  [C0603]
C229  2.2uF  [C0603]
C230  100nF  [C0603]
C231  100nF  [C0603]
C232  100nF  [C0603]
C233  100nF  [C0603]
C234  100nF  [C0603]
C235  100nF  [C0603]
C236  100nF  [C0603]
C237  100nF  [C0603]
C238  2.2nF  [C0603]
R145  10kΩ  [R0603]
R146  10kΩ  [R0603]
R147  10kΩ  [R0603]
R148  470Ω  [R0603]
R149  470Ω  [R0603]
R150  470Ω  [R0603]
R151  470Ω  [R0603]
STATUS1  209UYSYGW/S530-A3/R2  [LED-TH_3P-BD4.0-P2.54]
SW1  HB-PH3-25414PB2GOP  [HDR-TH_4P-P2.54-V-M]
U17  STM32H743VIT6  [LQFP-100_L14.0-W14.0-P0.50-LS16.0-BL]
sheet PSU
C192  100nF  [C0603]
C193  100nF  [C0603]
C194  10uF  [C0603]
C195  10uF  [C0603]
C196  10uF  [C0603]
C197  10uF  [C0603]
C198  1000uF  [CAP-TH_BD10.0-P5.00-D1.0-FD]
C201  100nF  [C0603]
C202  10uF  [C0603]
C203  10uF  [C0603]
C204  10uF  [C0603]
C210  1uF  [C0603]
D3  SS34  [SMA_L4.3-W2.6-LS5.2-RD]
L1  4.7uH  [IND-SMD_L7.0-W6.6_0630CDMCCDS]
POE_MODULE1  DP9700 at-12V2A  [PWRM-TH_DP9700-XX]
PWR_EXT1  ZX-XH2.54-2PZZ  [CONN-TH_2P-P2.50_HX25003-2A]
R123  10kΩ  [R0603]
R124  33kΩ  [R0603]
U18  AP62300WU-7  [TSOT-23-6_L2.9-W1.6-P0.95-LS2.8-BL]
U19  LD39200PUR  [DFN-6_L3.0-W3.0-P0.95-BL-EP-1]
U20  LD39200PUR  [DFN-6_L3.0-W3.0-P0.95-BL-EP-1]

## Library data of the parts
C116 C119 C127 C129 C133 C136 C141 C143 C146 C149 C150 C158 C160 C163 C166 C167 C175 C177 C180 C183-C185 C194-C197 C202-C204 C215 C218 C224 = CL10A106MQ8NNNC: Capacitance: Tolerance:±20% Tolerance:±20% Voltage Rated: Temperature Coefficient:; LCSC Part Name: 10uF ±20% 6.3V; Supplier Part: C1691; Manufacturer: SAMSUNG(三星); Supplier Footprint: 0603; JLCPCB Part Class: Extended Part; Datasheet: https://atta.szlcsc.com/upload/public/pdf/source/20160218/1457707763339.pdf; Supplier: LCSC; Tolerance: ±20%
R103 R104 R106 R107 R110 R111 R114 R115 R118 R119 R134 R136-R138 R140 = 0603WAF4701T5E: Type:Thick Film Resistors Resistance:4.7kΩ Tolerance:±1% Tolerance:±1% Power(Watts): Overload Voltage (Max): Temperature Coefficient:±100ppm/℃ Temperature Coefficient:±100ppm/℃ Operating Temperature Range:-55℃~+155℃ Operating Temperature Range:-55℃~+155℃; LCSC Part Name: 4.7kΩ ±1% 100mW 厚膜电阻; Supplier Part: C23162; Manufacturer: UNI-ROYAL(厚声); Supplier Footprint: 0603; JLCPCB Part Class: Basic Part; Datasheet: https://atta.szlcsc.com/upload/public/pdf/source/20200306/C422600_1E6D84923E4A46A82E41ADD87F860B5C.pdf; Supplier: LCSC; Type: Thick Film Resistors; Tolerance: ±1%; Temperature Coefficient: ±100ppm/℃; Operating Temperature Range: -55℃~+155℃
U16 = SI5351A-B-GTR: Interface:I2C Output Frequency (Max):200MHz Supply Voltage:2.25V~3.6V Supply Voltage:2.25V~3.6V Input Low Voltage:990mV Input Low Voltage:990mV Intput High Voltage:1.75V~3.6V Intput High Voltage:1.75V~3.6V Output Low Voltage:600mV Output Low Voltage:600mV; Supplier Part: C504891; Manufacturer: SKYWORKS/SILICON LABS(芯科); Supplier Footprint: MSOP-10; JLCPCB Part Class: Extended Part; Datasheet: https://atta.szlcsc.com/upload/public/pdf/source/20201217/C504891_43D9F8D26F790B9DA481E85A362B0988.pdf; Supplier: LCSC; Interface: I2C; Output Frequency (Max): 200MHz; Supply Voltage: 2.25V~3.6V; Input Low Voltage: 990mV; Intput High Voltage: 1.75V~3.6V; Output Low Voltage: 600mV; Output High Voltage: 1.9V; Operating Temperatue: -55℃~+150℃
X1 X2 = 7M-25.000MEEQ-T: Frequency:25MHz Normal temperature Frequency Tolerance:±10ppm Normal temperature Frequency Tolerance:±10ppm External load capacitor: Frequency Stability(Full temperature range):±10ppm Frequency Stability(Full temperature range):±10ppm Equivalent Series Re; LCSC Part Name: 25MHz ±10ppm 10pF; Supplier Part: C2450106; Manufacturer: TXC(晶技); Supplier Footprint: SMD3225-4P; JLCPCB Part Class: Extended Part; Datasheet: https://atta.szlcsc.com/upload/public/pdf/source/20211127/6EE84679934CC9A5D3E8ADDAA8A476F2.pdf; Supplier: LCSC; Normal temperature Frequency Tolerance: ±10ppm; Frequency Stability(Full temperature range): ±10ppm; Equivalent Series Resistance (ESR): 60Ω
C117 C124 C126 C128 C135 C140 C142 C148 C151 C157 C159 C165 C168 C174 C176 C182 C192 C193 C201 C214 C217 C223 C225 C230-C237 = CL10B104KC8NNNC: Capacitance: Tolerance:±10% Tolerance:±10% Voltage Rated: Temperature Coefficient:; LCSC Part Name: 100nF ±10% 100V; Supplier Part: C15725; Manufacturer: SAMSUNG(三星); Supplier Footprint: 0603; JLCPCB Part Class: Extended Part; Datasheet: https://atta.szlcsc.com/upload/public/pdf/source/20160218/1457707763339.pdf; Supplier: LCSC; Tolerance: ±10%
C118 C120 C121 C123 C125 C131 C137 C139 C152-C154 C156 C169-C171 C173 = 860020773013: Supplier Part: C7046938; Manufacturer: Wurth(伍尔特); Supplier Footprint: 插件; JLCPCB Part Class: Extended Part; Datasheet: https://atta.szlcsc.com/upload/public/pdf/source/20231023/860020773013.pdf-ae4cc118506be8cf0bae152b6102cbee.pdf; Supplier: LCSC
C122 C132 C138 C145 C155 C162 C172 C179 C238 = GRM1885C1H222JA01D: Capacitance: Tolerance:±5% Tolerance:±5% Voltage Rated: Temperature Coefficient:; LCSC Part Name: 2.2nF ±5% 50V; Supplier Part: C77033; Manufacturer: muRata(村田); Supplier Footprint: 0603; JLCPCB Part Class: Extended Part; Datasheet: https://atta.szlcsc.com/upload/public/pdf/source/20200305/C490387_23319AE8C154DEB24C505E6C82A8106A.pdf; Supplier: LCSC; Tolerance: ±5%
C130 C134 C144 C147 C161 C164 C178 C181 C228 C229 = CL10A225KA8NNNC: Capacitance: Tolerance:±10% Tolerance:±10% Voltage Rated: Temperature Coefficient:; LCSC Part Name: 2.2uF ±10% 25V; Supplier Part: C57895; Manufacturer: SAMSUNG(三星); Supplier Footprint: 0603; JLCPCB Part Class: Extended Part; Datasheet: https://atta.szlcsc.com/upload/public/pdf/source/20160218/1457707763339.pdf; Supplier: LCSC; Tolerance: ±10%
R100-R102 R105 R108 R109 R112 R113 R142 R143 R148-R151 = 0603WAF4700T5E: Type:Thick Film Resistors Resistance: Tolerance:±1% Tolerance:±1% Power(Watts): Overload Voltage (Max): Temperature Coefficient:±100ppm/℃ Temperature Coefficient:±100ppm/℃ Operating Temperature Range:-55℃~+155℃ Operating Temperature Range:-55℃~+155℃; LCSC Part Name: 470Ω ±1% 100mW 厚膜电阻; Supplier Part: C23179; Manufacturer: UNI-ROYAL(厚声); Supplier Footprint: 0603; JLCPCB Part Class: Basic Part; Datasheet: https://atta.szlcsc.com/upload/public/pdf/source/20200306/C422600_1E6D84923E4A46A82E41ADD87F860B5C.pdf; Supplier: LCSC; Type: Thick Film Resistors; Tolerance: ±1%; Temperature Coefficient: ±100ppm/℃; Operating Temperature Range: -55℃~+155℃
U12-U15 = PCM5122PW: Supplier Part: C1540085; Manufacturer: TI(德州仪器); Supplier Footprint: TSSOP-28-6.6mm; JLCPCB Part Class: Extended Part; Datasheet: https://www.ti.com/cn/lit/gpn/pcm5122; Supplier: LCSC
XLR9-XLR16 = NC3MAAV: Connector Type:XLR公插座 Current Rating (Max):- Operating Temperature Range:- Operating Temperature Range:-; Supplier Part: C368456; Manufacturer: NEUTRIK(优曲克); Supplier Footprint: 插件; JLCPCB Part Class: Extended Part; Datasheet: https://atta.szlcsc.com/upload/public/pdf/source/20190222/C368456_31BC63CD7F89810B6C1D06B0B5D92942.pdf; Supplier: LCSC; Connector Type: XLR公插座
C210 C216 = CL10A105KB8NNNC: Capacitance: Tolerance:±10% Tolerance:±10% Voltage Rated: Temperature Coefficient:; LCSC Part Name: 1uF ±10% 50V; Supplier Part: C15849; Manufacturer: SAMSUNG(三星); Supplier Footprint: 0603; JLCPCB Part Class: Basic Part; Datasheet: https://atta.szlcsc.com/upload/public/pdf/source/20160218/1457707763339.pdf; Supplier: LCSC; Tolerance: ±10%
C219 C221 = CL10C100JB8NNNC: Capacitance: Tolerance:±5% Tolerance:±5% Voltage Rated: Temperature Coefficient:; LCSC Part Name: 10pF ±5% 50V; Supplier Part: C1634; Manufacturer: SAMSUNG(三星); Supplier Footprint: 0603; JLCPCB Part Class: Basic Part; Datasheet: https://atta.szlcsc.com/upload/public/pdf/source/20160218/1457707763339.pdf; Supplier: LCSC; Tolerance: ±5%
C220 = CL10C471JC8NNNC: Capacitance: Tolerance:±5% Tolerance:±5% Voltage Rated: Temperature Coefficient:; LCSC Part Name: 470pF ±5% 100V; Supplier Part: C525649; Manufacturer: SAMSUNG(三星); Supplier Footprint: 0603; JLCPCB Part Class: Extended Part; Datasheet: https://atta.szlcsc.com/upload/public/pdf/source/20160218/1457707763339.pdf; Supplier: LCSC; Tolerance: ±5%
L3 = PT61017PEL: Turns Ratio:1CT:1CT Inductor:350uH operating temperature:0℃~+70℃ operating temperature:0℃~+70℃; Supplier Part: C124001; Manufacturer: BOURNS; Supplier Footprint: SMD,12.8x6.9mm; JLCPCB Part Class: Extended Part; Datasheet: https://atta.szlcsc.com/upload/public/pdf/source/20170810/C124001_1502335220058879754.pdf; Supplier: LCSC; Turns Ratio: 1CT:1CT; Inductor: 350uH; operating temperature: 0℃~+70℃
L4 = LQM2HPN1R0MGHL: Inductance: Tolerance:±20% Tolerance:±20% Rated Current: Saturation Current (Isat): DC Resistance (DCR): Q @ Freq:- Frequency - Self Resonant: Ratings: Type:叠层电感; LCSC Part Name: 1uH ±20% 2A; Supplier Part: C162587; Manufacturer: muRata(村田); Supplier Footprint: 1008; JLCPCB Part Class: Extended Part; Datasheet: https://atta.szlcsc.com/upload/public/pdf/source/20190724/C171762_9C8CF7B0694612DCE2545660DA2A3B9B.pdf; Supplier: LCSC; Tolerance: ±20%; Type: 叠层电感
LED1 LED2 = MHT192JGCT: Emitted Color:Green-yellow Power Dissipation:60mW Forward Current:5mA Dominant Wavelength:572nm Dominant Wavelength:572nm Peak Wavelength:571nm Diode Configuration:- Lens Color:无色透明透镜 Color Temperature:- Color Temperature:- Viewing Angle:120° Mounting Syt; LCSC Part Name: 普绿/黄绿; Supplier Part: C473820; Manufacturer: MEIHUA(美华); Supplier Footprint: 0603; JLCPCB Part Class: Extended Part; Datasheet: https://atta.szlcsc.com/upload/public/pdf/source/20191226/C473820_92F66B1E2C08E6ED06F9017989DCEAB5.pdf; Supplier: LCSC; Emitted Color: Green-yellow; Power Dissipation: 60mW; Forward Current: 5mA; Dominant Wavelength: 572nm; Peak Wavelength: 571nm; Lens Color: 无色透明透镜; Viewing Angle: 120°; Operating Temperature: -40℃~+85℃
R127-R130 R132 R133 R139 R141 = 0603WAF470JT5E: Type:Thick Film Resistors Resistance:47Ω Tolerance:±1% Tolerance:±1% Power(Watts): Overload Voltage (Max): Temperature Coefficient:±100ppm/℃ Temperature Coefficient:±100ppm/℃ Operating Temperature Range:-55℃~+155℃ Operating Temperature Range:-55℃~+155℃; LCSC Part Name: 47Ω ±1% 100mW 厚膜电阻; Supplier Part: C23182; Manufacturer: UNI-ROYAL(厚声); Supplier Footprint: 0603; JLCPCB Part Class: Basic Part; Datasheet: https://atta.szlcsc.com/upload/public/pdf/source/20200306/C422600_1E6D84923E4A46A82E41ADD87F860B5C.pdf; Supplier: LCSC; Type: Thick Film Resistors; Tolerance: ±1%; Temperature Coefficient: ±100ppm/℃; Operating Temperature Range: -55℃~+155℃
R131 = 0603WAF1212T5E: Type:Thick Film Resistors Resistance:12.1kΩ Tolerance:±1% Tolerance:±1% Power(Watts): Overload Voltage (Max): Temperature Coefficient:±100ppm/℃ Temperature Coefficient:±100ppm/℃ Operating Temperature Range:-55℃~+155℃ Operating Temperature Range:-55℃~+155℃; LCSC Part Name: 12.1kΩ ±1% 100mW 厚膜电阻; Supplier Part: C22864; Manufacturer: UNI-ROYAL(厚声); Supplier Footprint: 0603; JLCPCB Part Class: Extended Part; Datasheet: https://atta.szlcsc.com/upload/public/pdf/source/20200306/C422600_1E6D84923E4A46A82E41ADD87F860B5C.pdf; Supplier: LCSC; Type: Thick Film Resistors; Tolerance: ±1%; Temperature Coefficient: ±100ppm/℃; Operating Temperature Range: -55℃~+155℃
R135 = 0603WAF1501T5E: Type:Thick Film Resistors Resistance:1.5kΩ Tolerance:±1% Tolerance:±1% Power(Watts): Overload Voltage (Max): Temperature Coefficient:±100ppm/℃ Temperature Coefficient:±100ppm/℃ Operating Temperature Range:-55℃~+155℃ Operating Temperature Range:-55℃~+155℃; LCSC Part Name: 1.5kΩ ±1% 100mW 厚膜电阻; Supplier Part: C22843; Manufacturer: UNI-ROYAL(厚声); Supplier Footprint: 0603; JLCPCB Part Class: Basic Part; Datasheet: https://atta.szlcsc.com/upload/public/pdf/source/20200306/C422600_1E6D84923E4A46A82E41ADD87F860B5C.pdf; Supplier: LCSC; Type: Thick Film Resistors; Tolerance: ±1%; Temperature Coefficient: ±100ppm/℃; Operating Temperature Range: -55℃~+155℃
R123 R144-R147 = RC0603FR-0710KL: Type:Thick Film Resistors Resistance: Tolerance:±1% Tolerance:±1% Power(Watts): Overload Voltage (Max): Temperature Coefficient:±100ppm/℃ Temperature Coefficient:±100ppm/℃ Operating Temperature Range:-55℃~+155℃ Operating Temperature Range:-55℃~+155℃; LCSC Part Name: 厚膜电阻 10kΩ ±1% 100mW; Supplier Part: C98220; Manufacturer: YAGEO(国巨); Supplier Footprint: 0603; JLCPCB Part Class: Extended Part; Datasheet: https://atta.szlcsc.com/upload/public/pdf/source/20180927/C295883_E8D83085EA81BD7DE0B2B681138C15EE.pdf; Supplier: LCSC; Type: Thick Film Resistors; Tolerance: ±1%; Temperature Coefficient: ±100ppm/℃; Operating Temperature Range: -55℃~+155℃
RJ45 = B8B-XH-AM: Pins Structure:1x8P Pitch:2.5mm Mounting Style:Straight Reference Series:XH Number of Pins:8P Number of Rows:1 Number of PINs Per Row:8 Row Spacing:- Current Rating (Max):3A Contact Material:Brass Contact Plating:Tin Operating Temperature Range:-25℃~+85℃; LCSC Part Name: 1x8P 间距:2.5mm 直插 系列:XH; Supplier Part: C5306535; Manufacturer: JST; Supplier Footprint: 插件; JLCPCB Part Class: Extended Part; Datasheet: https://atta.szlcsc.com/upload/public/pdf/source/20210915/55C2150F8D01CCBD7F61D7DC07E45ED6.pdf; Supplier: LCSC; Pins Structure: 1x8P; Pitch: 2.5mm; Mounting Style: Straight; Reference Series: XH; Number of Pins: 8P; Number of Rows: 1; Number of PINs Per Row: 8; Current Rating (Max): 3A; Contact Material: Brass; Contact Plating: Tin; Operating Temperature Range: -25℃~+85℃; Rated Voltage (Max): 250V; Plastic Material: PA66; Flame Retardant Rating: UL94V-0; Supplementary Features: 打K脚；带柱; Z-Height of the Board: 7mm; X-Length of Bottom Edge on Board (Spacing Line): 22.4mm; Y-Width of Bottom Edge on Board: 5.75mm
U22 = LAN8742A-CZ: Application Function: Number of Channels: Interface:; Supplier Part: C220794; Manufacturer: MICROCHIP(美国微芯); Supplier Footprint: QFN-24-EP(4x4); JLCPCB Part Class: Extended Part; Datasheet: https://atta.szlcsc.com/upload/public/pdf/source/20180530/C220794_9169BD3847B6C9AB12203128110311CE.pdf; Supplier: LCSC
U23-U26 = MMSZ5228B_C22399895: Diode Configuration:Independent Type Zener Voltage (Nom):3.9V Reverse Leakage Current (Ir):15uA@1V Zener Voltage (Range):3.71V~4.1V Zener Voltage (Range):3.71V~4.1V Power Dissipation:500mW Zener Impedance (Zzt):23Ω; Supplier Part: C22399895; Manufacturer: 宏迦橙; Supplier Footprint: SOD-123; JLCPCB Part Class: Extended Part; Datasheet: https://atta.szlcsc.com/upload/public/pdf/source/20240516/6509CA52923B09B0B2DB4373BE4DDE10.pdf; Supplier: LCSC; Diode Configuration: Independent Type; Zener Voltage (Nom): 3.9V; Reverse Leakage Current (Ir): 15uA@1V; Zener Voltage (Range): 3.71V~4.1V; Power Dissipation: 500mW; Zener Impedance (Zzt): 23Ω
STATUS1 = 209UYSYGW/S530-A3/R2: Lamp Holder Type:3mm圆形灯头 Emitted Color:Yellow,Green-yellow Power Dissipation:60mW Forward Current:20mA Dominant Wavelength:573nm；589nm Dominant Wavelength:573nm；589nm Peak Wavelength:575nm；591nm Diode Configuration:Common anode Lens Color:雾状白透镜 Color Temp; LCSC Part Name: 黄灯,普绿/黄绿; Supplier Part: C409519; Manufacturer: EVERLIGHT(亿光); Supplier Footprint: 插件,D=3mm; JLCPCB Part Class: Extended Part; Datasheet: https://atta.szlcsc.com/upload/public/pdf/source/20190822/C409519_958D92627C3266250A1BDC5F14ED599F.pdf; Supplier: LCSC; Lamp Holder Type: 3mm圆形灯头; Emitted Color: Yellow,Green-yellow; Power Dissipation: 60mW; Forward Current: 20mA; Dominant Wavelength: 573nm；589nm; Peak Wavelength: 575nm；591nm; Diode Configuration: Common anode; Lens Color: 雾状白透镜; Viewing Angle: 50°; Operating Temperature: -40℃~+85℃
SW1 = HB-PH3-25414PB2GOP: Pin Structure:1x4P Pitch:2.54mm Row Spacing:2.54mm Circluar Pins/Square Pins:Square Pins Mounting Type:Straight Number of Rows:Plugin Number of Pins:4P Current Rating (Max):3A Voltage Rating (Max):250V Length of Mating Pin:6mm Insulation Height:2.54mm Len; LCSC Part Name: 间距:2.54mm 1x4P 直插 方针; Supplier Part: C6332197; Manufacturer: HANBO(汉博); Supplier Footprint: 插件,P=2.54mm; JLCPCB Part Class: Extended Part; Datasheet: https://atta.szlcsc.com/upload/public/pdf/source/20230803/F72D259687963761DF1B552F3BB84A31.pdf; Supplier: LCSC; Pin Structure: 1x4P; Pitch: 2.54mm; Row Spacing: 2.54mm; Circluar Pins/Square Pins: Square Pins; Mounting Type: Straight; Number of Rows: Plugin; Number of Pins: 4P; Current Rating (Max): 3A; Voltage Rating (Max): 250V; Length of Mating Pin: 6mm; Insulation Height: 2.54mm; Length of End Connection Pin: 3mm; Contact Plating: Gold; Operating Temperature Range: -40℃~+105℃; Soldering Temperature(Max): 260℃; Color: Black
U17 = STM32H743VIT6: CPU Core:ARM-MSeries GPIO Ports Number:82 Operating Voltage Range:1.71V~3.6V Operating Voltage Range:1.71V~3.6V CPU Maximum Speed:480MHz Operating Temperature Range:-40℃~+85℃ Operating Temperature Range:-40℃~+85℃ ADC (Bit):16bit DAC (Bit):12bit Universal; Supplier Part: C529058; Manufacturer: ST(意法半导体); Supplier Footprint: LQFP-100(14x14); JLCPCB Part Class: Extended Part; Datasheet: https://atta.szlcsc.com/upload/public/pdf/source/20200508/C529058_DA70143F266D6D825C3A912656F12A87.pdf; Supplier: LCSC; CPU Core: ARM-MSeries; GPIO Ports Number: 82; Operating Voltage Range: 1.71V~3.6V; CPU Maximum Speed: 480MHz; Operating Temperature Range: -40℃~+85℃; ADC (Bit): 16bit; DAC (Bit): 12bit; Universal Serial Bus: 有; Secure Digital Input and Output: 有; Direct Memory Access: 有
C198 = 25PK1000MEFC10*16: Capacitance: Tolerance:±20% Tolerance:±20% Rated Voltage: Ripple Current:870mA@120Hz Equivalent Series Resistance(ESR):- Lead Spacing: φD: L: Lifetime @ Temp:2000hrs@85℃ Operating Temperature:-25℃~+85℃ Operating Temperature:-25℃~+85℃; LCSC Part Name: 1000uF ±20% 25V; Supplier Part: C109451; Manufacturer: rubycon(红宝石); Supplier Footprint: 插件,D10xL16mm; JLCPCB Part Class: Extended Part; Datasheet: https://atta.szlcsc.com/upload/public/pdf/source/20170428/1493376785021.pdf; Supplier: LCSC; Tolerance: ±20%; Ripple Current: 870mA@120Hz; Lifetime @ Temp: 2000hrs@85℃; Operating Temperature: -25℃~+85℃
D3 = SS34_C8678: Diode Configuration:Single Forward Voltage (Vf@If):550mV@3A Reverse Voltage (Vr):40V Average Rectified Current (Io):3A Reverse Leakage Current (Ir):500uA@40V; LCSC Part Name: 电压:40V 电流:3A; Supplier Part: C8678; Manufacturer: MDD; Supplier Footprint: SMA(DO-214AC); JLCPCB Part Class: Basic Part; Datasheet: https://atta.szlcsc.com/upload/public/pdf/source/20230314/A80AE34493C69B89E2F4B1712F433538.pdf; Supplier: LCSC; Diode Configuration: Single; Forward Voltage (Vf@If): 550mV@3A; Reverse Voltage (Vr): 40V; Average Rectified Current (Io): 3A; Reverse Leakage Current (Ir): 500uA@40V
L1 = 0630CDMCDDS-4R7MC: Inductance: Tolerance:±20% Tolerance:±20% Rated Current: Saturation Current (Isat):6.8A DC Resistance (DCR): Type:- Ratings:-; LCSC Part Name: 4.7uH ±20% 6.8A; Supplier Part: C2453469; Manufacturer: Sumida(胜美达); Supplier Footprint: SMD,7x6.6mm; JLCPCB Part Class: Extended Part; Datasheet: https://atta.szlcsc.com/upload/public/pdf/source/20200309/C492723_5B4769124B99343D76BBAFA56B014E05.pdf; Supplier: LCSC; Tolerance: ±20%; Saturation Current (Isat): 6.8A
POE_MODULE1 = DP9700 at-12V2A: LCSC Part Name: 25.5W POE模块（隔离型）; Supplier Part: C5380092; Manufacturer: SDAPO(达普); JLCPCB Part Class: Extended Part; Datasheet: https://atta.szlcsc.com/upload/public/pdf/source/20230403/873A7AE8DDB76A9EA934D268F11FD383.pdf; Supplier: LCSC
PWR_EXT1 = ZX-XH2.54-2PZZ: Pins Structure:1x2P Pitch:2.54mm Mounting Style:Straight Reference Series:XH Number of Pins:2P Number of Rows:1 Number of PINs Per Row:2 Row Spacing:- Current Rating (Max):3A Contact Material:Brass Contact Plating:Tin Operating Temperature Range:-25℃~+85℃; Supplier Part: C7429632; Manufacturer: Megastar(兆星); Supplier Footprint: 插件,P=2.54mm; JLCPCB Part Class: Extended Part; Datasheet: https://atta.szlcsc.com/upload/public/pdf/source/20230619/19BA6947230AA44A04D3EDD65E618FD0.pdf; Supplier: LCSC; Pins Structure: 1x2P; Pitch: 2.54mm; Mounting Style: Straight; Reference Series: XH; Number of Pins: 2P; Number of Rows: 1; Number of PINs Per Row: 2; Current Rating (Max): 3A; Contact Material: Brass; Contact Plating: Tin; Operating Temperature Range: -25℃~+85℃
R124 = 0603WAF4702T5E: Type:Thick Film Resistors Resistance:47kΩ Tolerance:±1% Tolerance:±1% Power(Watts): Overload Voltage (Max): Temperature Coefficient:±100ppm/℃ Temperature Coefficient:±100ppm/℃ Operating Temperature Range:-55℃~+155℃ Operating Temperature Range:-55℃~+155℃; LCSC Part Name: 47kΩ ±1% 100mW 厚膜电阻; Supplier Part: C25819; Manufacturer: UNI-ROYAL(厚声); Supplier Footprint: 0603; JLCPCB Part Class: Basic Part; Datasheet: https://atta.szlcsc.com/upload/public/pdf/source/20200306/C422600_1E6D84923E4A46A82E41ADD87F860B5C.pdf; Supplier: LCSC; Type: Thick Film Resistors; Tolerance: ±1%; Temperature Coefficient: ±100ppm/℃; Operating Temperature Range: -55℃~+155℃
U18 = AP62300WU-7: Function:Step-down type Output Type:Adjustable Input Voltage:4.2V~18V Input Voltage:4.2V~18V Output Voltage:800mV~7V Output Voltage:800mV~7V Output Current (Max):3A Switching Frequency:750kHz Operating Temperature:-40℃~+85℃@(TA) Operating Temperature:-40℃; Supplier Part: C1880390; Manufacturer: DIODES(美台); Supplier Footprint: TSOT-23-6; JLCPCB Part Class: Extended Part; Datasheet: https://atta.szlcsc.com/upload/public/pdf/source/20221028/76FC231195B26EEAF8CA165FB3593268.pdf; Supplier: LCSC; Function: Step-down type; Output Type: Adjustable; Input Voltage: 4.2V~18V; Output Voltage: 800mV~7V; Output Current (Max): 3A; Switching Frequency: 750kHz; Operating Temperature: -40℃~+85℃@(TA); Synchronous Rectification: Yes; Number of Outputs: 1; Topology: Step-down; Switch tube (built-in/external): 内置
U19 U20 = LD39200PUR: Output Type:可调 Maximum Input Voltage:6V Output Voltage:500mV~5.75V Output Voltage:500mV~5.75V MAX Output Current:2A Dropout Voltage:250mV@(2A) standby current:300uA Operating Temperature:-40℃~+125℃@(Tj) Operating Temperature:-40℃~+125℃@(Tj) Output Polarit; Supplier Part: C2969757; Manufacturer: ST(意法半导体); Supplier Footprint: DFN-6(3x3); JLCPCB Part Class: Extended Part; Datasheet: https://atta.szlcsc.com/upload/public/pdf/source/20221107/39B3427E03112C9DD294DB41D502BD53.pdf; Supplier: LCSC; Output Type: 可调; Maximum Input Voltage: 6V; Output Voltage: 500mV~5.75V; MAX Output Current: 2A; Dropout Voltage: 250mV@(2A); standby current: 300uA; Operating Temperature: -40℃~+125℃@(Tj); Output Polarity: Positive electrode; Number of Outputs: 1

## Nets
12V: C192.2 C198.1 C210.2 D3.1(K) POE_MODULE1.8(+12VDC) U18.3(VIN)
A3V3: C116.2 C117.2 C119.2 C124.2 C128.2 C129.2 C142.2 C143.2 C150.2 C151.2 C159.2 C160.2 C167.2 C168.2 C176.2 C177.2 C204.1 U12.1(CPVDD) U12.8(AVDD) U13.1(CPVDD) U13.8(AVDD) U14.1(CPVDD) U14.8(AVDD) U15.1(CPVDD) U15.8(AVDD) U20.1(OUT) U20.2(ADJ/sense)
D3V3: C126.2 C127.2 C140.2 C141.2 C157.2 C158.2 C174.2 C175.2 C184.1 C185.1 C202.1 C218.2 C223.2 C224.1 C225.2 C230.2 C231.2 C232.2 C233.2 C234.2 C235.2 C236.2 L4.2 R118.2 R119.2 R135.2 R136.2 R137.2 R138.2 R140.2 R147.2 STATUS1.2 SW1.2 U12.18(MODE2) U12.28(DVDD) U13.18(MODE2) U13.24(ADR1) U13.28(DVDD) U14.16(ADR2) U14.18(MODE2) U14.28(DVDD) U15.16(ADR2) U15.18(MODE2) U15.24(ADR1) U15.28(DVDD) U16.1(VDD) U16.7(VDDO) U17.6(VBAT) U17.11(VDD) U17.20(VREF+) U17.21(VDDA) U17.27(VDD) U17.50(VDD) U17.75(VDD) U17.100(VDD) U19.1(OUT) U19.2(ADJ/sense) U22.9(VDDIO)
GND: C116.1 C117.1 C119.1 C122.2 C124.1 C126.1 C127.1 C128.1 C129.1 C130.1 C132.1 C133.1 C135.1 C136.1 C138.2 C140.1 C141.1 C142.1 C143.1 C144.1 C145.1 C146.1 C148.1 C149.1 C150.1 C151.1 C155.2 C157.1 C158.1 C159.1 C160.1 C161.1 C162.1 C163.1 C165.1 C166.1 C167.1 C168.1 C172.2 C174.1 C175.1 C176.1 C177.1 C178.1 C179.1 C180.1 C182.1 C183.1 C184.2 C185.2 C192.1 C194.1 C195.1 C196.1 C197.1 C198.2 C201.2 C202.2 C203.2 C204.2 C210.1 C214.1 C215.2 C216.1 C217.1 C218.1 C219.1 C220.1 C221.2 C223.1 C224.2 C225.1 C228.2 C229.2 C230.1 C231.1 C232.1 C233.1 C234.1 C235.1 C236.1 C237.1 C238.1 POE_MODULE1.7(-12VDC) PWR_EXT1.1 R103.1 R104.1 R106.1 R107.1 R110.1 R111.1 R114.1 R115.1 R123.2 R131.2 R134.2 R142.2 R143.2 R145.2 R146.2 R150.2 R151.2 SW1.1 U12.3(CPGND) U12.9(AGND) U12.16(ADR2) U12.17(MODE1) U12.24(ADR1) U12.27(DGND) U13.3(CPGND) U13.9(AGND) U13.16(ADR2) U13.17(MODE1) U13.27(DGND) U14.3(CPGND) U14.9(AGND) U14.17(MODE1) U14.24(ADR1) U14.27(DGND) U15.3(CPGND) U15.9(AGND) U15.17(MODE1) U15.27(DGND) U16.8(GND) U17.10(VSS) U17.19(VSSA) U17.26(VSS) U17.49(VSS) U17.74(VSS) U17.99(VSS) U18.1(GND) U19.3(GND) U19.7(EP) U20.3(GND) U20.7(EP) U22.25(EP) X1.2(GND) X1.4(GND) X2.2(GND) X2.4(GND) XLR9.1 XLR9.4 XLR10.1 XLR10.4 XLR11.1 XLR11.4 XLR12.1 XLR12.4 XLR13.1 XLR13.4 XLR14.1 XLR14.4 XLR15.1 XLR15.4 XLR16.1 XLR16.4
VINT: C194.2 C195.2 C196.2 C197.2 C203.1 L1.2 R124.2 U19.5(EN) U19.6(IN) U20.5(EN) U20.6(IN)
BCK: R151.1 U12.20(SCK) U12.21(BCK) U13.20(SCK) U13.21(BCK) U14.20(SCK) U14.21(BCK) U15.20(SCK) U15.21(BCK) U16.9(CLK1) U17.4(PE5)
DAC_TDM: R150.1 U12.22(DIN) U13.22(DIN) U14.22(DIN) U15.22(DIN) U17.5(PE6)
ETH_CRS_DV: R141.1 U17.31(PA7)
ETH_MDC: U17.16(PC1) U22.13(MDC)
ETH_MDIO: R135.1 U17.24(PA2) U22.12(MDIO)
ETH_REFCLK: R139.1 U17.23(PA1)
ETH_RST: U17.30(PA6) U22.15(nRST)
ETH_RXD0: R132.2 U17.32(PC4)
ETH_RXD1: R133.2 U17.33(PC5)
ETH_TXD0: U17.51(PB12) U22.17(TXD0)
ETH_TXD1: U17.52(PB13) U22.18(TXD1)
ETH_TXEN: U17.47(PB11) U22.16(TXEN)
FS: C238.2 U12.23(LRCK) U13.23(LRCK) U14.23(LRCK) U15.23(LRCK) U16.10(CLK0) U17.3(PE4)
GLED: LED1.2(+) R144.1 U22.2(LED2/nINT/nPME/nINTSEL)
LED3: R149.2 U17.53(PB14)
LED4: R148.2 U17.54(PB15)
RJ45_4+5: POE_MODULE1.3(VB1) RJ45.4 RJ45.5
RJ45_7+8: POE_MODULE1.4(VB2) RJ45.1 RJ45.2
RX: U17.37(PE7)
SCLs: R119.1 U12.12(SCL) U13.12(SCL) U14.12(SCL) U15.12(SCL) U16.4(SCL) U17.67(PA8)
SDAs: R118.1 U12.11(SDA) U13.11(SDA) U14.11(SDA) U15.11(SDA) U16.5(SDA) U17.66(PC9)
SWCLK: R146.1 SW1.3 U17.76(PA14)
SWDIO: R147.1 SW1.4 U17.72(PA13)
TR_1/2MID: L3.10(RX-CT) POE_MODULE1.1(VA1)
TR_3/6MID: L3.15(TX-CT) POE_MODULE1.2(VA2)
TX: U17.38(PE8)
XTAL1: C221.1 U22.5(XTAL1/CLKIN) X2.1(OSC1)
XTAL2: C219.2 U22.4(XTAL2) X2.3(OSC2)
YLED: LED2.2(+) U22.3(LED1/nINT/nPME/REGOFF)
$1N3366: C120.2 C132.2 R101.2
$1N3367: C120.1 XLR9.2
$1N3368: C118.1 XLR9.3
$1N3369: C123.1 XLR10.3
$1N3370: C121.1 XLR10.2
$1N3387: R101.1 U12.6(OUTL)
$1N3395: C121.2 C122.1 R102.2
$1N3400: C133.2 U12.10(VCOM)
$1N3402: C130.2 U12.5(VNEG)
$1N3404: C134.2 U12.4(CAPM)
$1N3405: C134.1 U12.2(CAPP)
$1N3410: C135.2 C136.2 U12.26(LDOO)
$1N3411: C123.2 R103.2
$1N3412: C118.2 R104.2
$1N3413: R102.1 U12.7(OUTR)
$3N1313: C131.2 C145.2 R100.2
$3N1314: C131.1 XLR12.2
$3N1315: C125.1 XLR12.3
$3N1316: C139.1 XLR11.3
$3N1317: C137.1 XLR11.2
$3N1341: C137.2 C138.1 R105.2
$3N1346: C146.2 U13.10(VCOM)
$3N1348: C144.2 U13.5(VNEG)
$3N1350: C147.2 U13.4(CAPM)
$3N1351: C147.1 U13.2(CAPP)
$3N1356: C148.2 C149.2 U13.26(LDOO)
$3N1357: C139.2 R106.2
$3N1358: C125.2 R107.2
$3N1404: R100.1 U13.7(OUTR)
$3N1417: R105.1 U13.6(OUTL)
$6N1327: C153.2 C162.2 R108.2
$6N1328: C153.1 XLR14.2
$6N1329: C152.1 XLR14.3
$6N1330: C156.1 XLR13.3
$6N1331: C154.1 XLR13.2
$6N1356: C154.2 C155.1 R109.2
$6N1360: C163.2 U14.10(VCOM)
$6N1362: C161.2 U14.5(VNEG)
$6N1364: C164.2 U14.4(CAPM)
$6N1365: C164.1 U14.2(CAPP)
$6N1370: C165.2 C166.2 U14.26(LDOO)
$6N1371: C156.2 R110.2
$6N1372: C152.2 R111.2
$6N1424: R109.1 U14.6(OUTL)
$6N1431: R108.1 U14.7(OUTR)
$10N1313: C170.2 C179.2 R112.2
$10N1314: C170.1 XLR16.2
$10N1315: C169.1 XLR16.3
$10N1316: C173.1 XLR15.3
$10N1317: C171.1 XLR15.2
$10N1340: R112.1 U15.7(OUTR)
$10N1341: C171.2 C172.1 R113.2
$10N1345: C180.2 U15.10(VCOM)
$10N1347: C178.2 U15.5(VNEG)
$10N1349: C181.2 U15.4(CAPM)
$10N1350: C181.1 U15.2(CAPP)
$10N1355: C182.2 C183.2 U15.26(LDOO)
$10N1356: C173.2 R114.2
$10N1357: C169.2 R115.2
$10N1448: R113.1 U15.6(OUTL)
$15N1912: L3.9(RX-) RJ45.8
$15N1913: L3.11(RX+) RJ45.7
$15N1916: L3.14(TX-) RJ45.6
$15N1917: L3.16(TX+) RJ45.3
$15N1918: L3.1(TD+) R128.1 U22.21(TXP) U25.2(K)
$15N1919: L3.3(TD-) R127.1 U22.20(TXN) U24.2(K)
$15N1920: L3.8(RD-) R129.1 U22.22(RXN) U23.2(K)
$15N1922: L3.6(RD+) R130.1 U22.23(RXP) U26.2(K)
$15N1927: R131.1 U22.24(RBIAS)
$15N1929: C214.2 C215.1 C217.2 L3.2(TD-CT) L3.7(RD-CT) L4.1 R127.2 R128.2 R129.2 R130.2 U22.1(VDD2A) U22.19(VDD1A)
$15N1934: R134.1 U22.10(RXER/PHYAD0)
$15N1936: R133.1 R136.1 U22.7(RXD1/MODE1)
$15N1937: R132.1 R137.1 U22.8(RXD0/MODE0)
$15N1948: C216.2 C220.2 U22.6(VDDCR)
$15N1949: R138.1 R139.2 U22.14(nINT/REFCLKO)
$15N1957: R140.1 R141.2 U22.11(CRS_DV/MODE2)
$15N1969: LED1.1(-) R142.1 R144.2
$15N1970: LED2.1(-) R143.1
$15N5576: U24.1(A) U25.1(A)
$15N5578: U23.1(A) U26.1(A)
$20N2087: R145.1 U17.94(BOOT0)
$20N2106: C237.2 U17.14(NRST)
$20N2132: C229.1 U17.73(VCAP)
$20N2133: C228.1 U17.48(VCAP)
$20N2146: R149.1 STATUS1.1
$20N2149: R148.1 STATUS1.3
$25N552: D3.2(A) PWR_EXT1.2
$25N1137: C193.2 L1.1 U18.2(SW)
$25N1140: C193.1 U18.6(BST)
$25N1141: R123.1 R124.1 U18.4(FB)
$25N1149: C201.1 U18.5(EN)
$27N3807: U16.3(XB) X1.3(OSC2)
$27N3810: U16.2(XA) X1.1(OSC1)

Not connected (* = marked no-connect by the designer): L3 4(NC)* 5(NC)* 12(NC)* 13(NC)*; POE_MODULE1 5(NC)* 6(NC)* 9(NC)* 10(NC)*; U12 13(GPIO5)* 14(GPIO4)* 15(GPIO3)* 19(GPIO6)* 25(XSMT)*; U13 13(GPIO5)* 14(GPIO4)* 15(GPIO3)* 19(GPIO6)* 25(XSMT)*; U14 13(GPIO5)* 14(GPIO4)* 15(GPIO3)* 19(GPIO6)* 25(XSMT)*; U15 13(GPIO5)* 14(GPIO4)* 15(GPIO3)* 19(GPIO6)* 25(XSMT)*; U16 6(CLK2)*; U17 1(PE2)* 2(PE3)* 7(PC13)* 8(PC14-OSC32_IN)* 9(PC15-OSC32_OUT)* 12(PH0-OSC_IN)* 13(PH1-OSC_OUT)* 15(PC0)* 17(PC2_C)* 18(PC3_C)* 22(PA0)* 25(PA3)* 28(PA4)* 29(PA5)* 34(PB0)* 35(PB1)* 36(PB2)* 39(PE9)* 40(PE10)* 41(PE11)* 42(PE12)* 43(PE13)* 44(PE14)* 45(PE15)* 46(PB10)* 55(PD8)* 56(PD9)* 57(PD10)* 58(PD11)* 59(PD12)* 60(PD13)* 61(PD14)* 62(PD15)* 63(PC6)* 64(PC7)* 65(PC8)* 68(PA9)* 69(PA10)* 70(PA11)* 71(PA12)* 77(PA15)* 78(PC10)* 79(PC11)* 80(PC12)* 81(PD0)* 82(PD1)* 83(PD2)* 84(PD3) 85(PD4)* 86(PD5)* 87(PD6)* 88(PD7)* 89(PB3)* 90(PB4)* 91(PB5)* 92(PB6)* 93(PB7)* 95(PB8)* 96(PB9)* 97(PE0)* 98(PE1)*; U19 4(PG)*; U20 4(PG)*

## Notes on the sheets
sheet 1
- 0x98
sheet 2
- 0x9A
sheet 3
- 0x9C
sheet 4
- 0x9E
sheet 6
- R150 and R151 are not populated
sheet 8
- 0x60
